# Altium project GZ7_1_x.PrjPcb
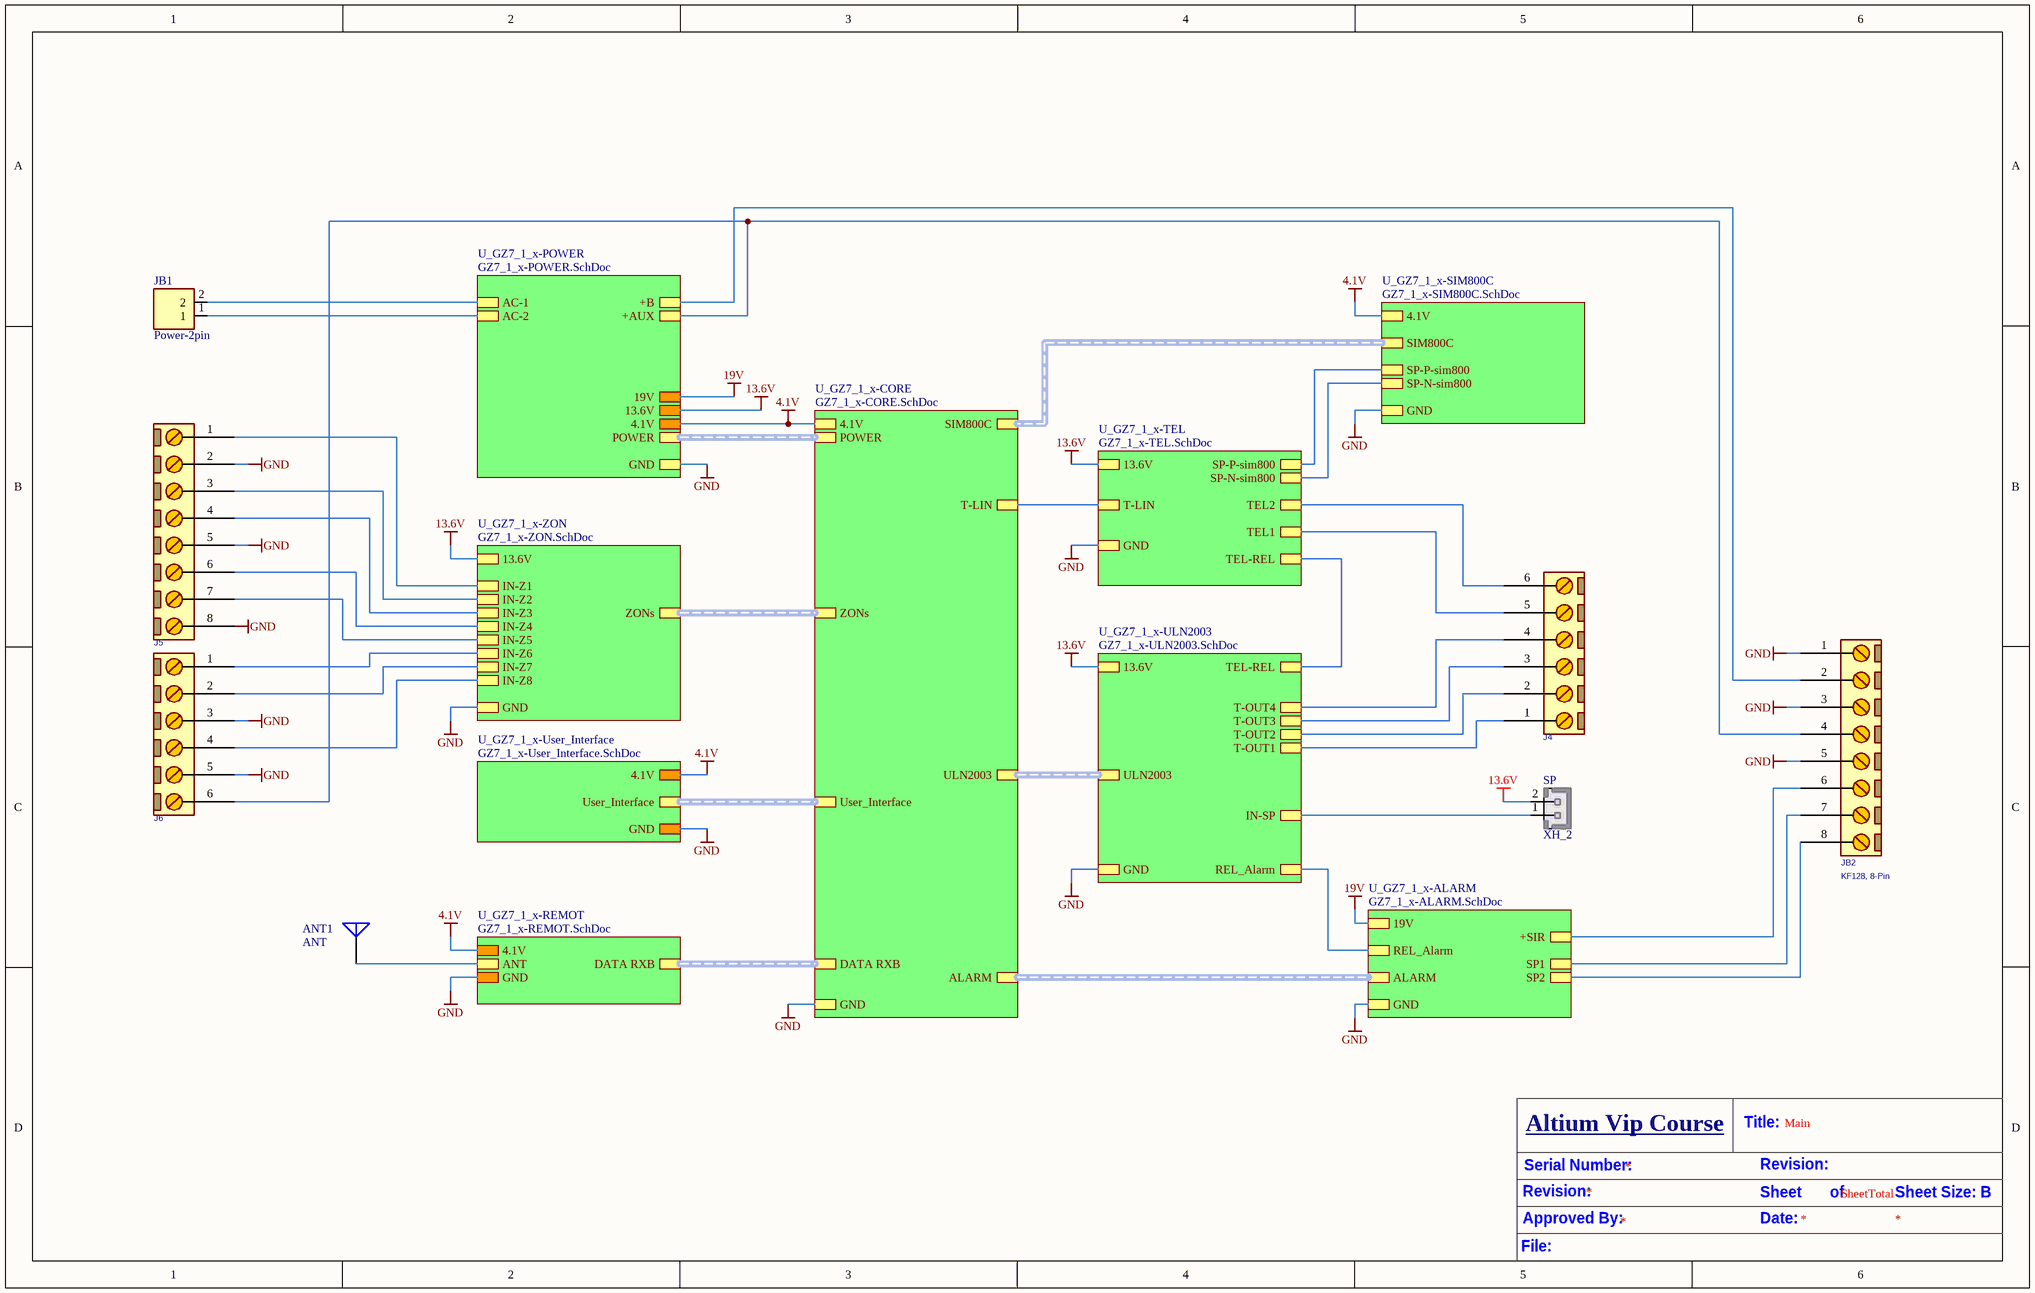
[diagram p0: Main.SchDoc]
10 sheets, 179 parts. Net scope: hierarchical (ports join the sheet entries above them; power ports are global).
Board file: GZ7_1_x.PcbDoc
Sheets:
  Main.SchDoc
    U_GZ7_1_x-POWER = GZ7_1_x-POWER.SchDoc
    U_GZ7_1_x-ZON = GZ7_1_x-ZON.SchDoc
    U_GZ7_1_x-User_Interface = GZ7_1_x-User_Interface.SchDoc
    U_GZ7_1_x-REMOT = GZ7_1_x-REMOT.SchDoc
    U_GZ7_1_x-CORE = GZ7_1_x-CORE.SchDoc
    U_GZ7_1_x-TEL = GZ7_1_x-TEL.SchDoc
    U_GZ7_1_x-ULN2003 = GZ7_1_x-ULN2003.SchDoc
    U_GZ7_1_x-SIM800C = GZ7_1_x-SIM800C.SchDoc
    U_GZ7_1_x-ALARM = GZ7_1_x-ALARM.SchDoc

## Sheet Main.SchDoc: Main
size B; SheetNumber: 1; SheetTotal: 10

### Parts
ANT1  ANT  [PAD-ANT]
J4  CONN_TB6  [T_4_OUT_TEL]  (value not drawn)
J5  CONN_TB8  [CON-Z_1_4]  (value not drawn)
J6  CONN_TB6  [CON-Z_5_8]  (value not drawn)
JB1  Power-2pin  [PWL_2]
JB2  KF128, 8-Pin  [CON8-AUX]
SP  XH_2  [XH_2]

### Sub-sheets
U_GZ7_1_x-ALARM = GZ7_1_x-ALARM.SchDoc: 19V, REL_Alarm, GND, +SIR, SP2, SP1, ALARM (harness a_ALARM)
U_GZ7_1_x-CORE = GZ7_1_x-CORE.SchDoc: 4.1V, GND, ZONs (harness ZON), SIM800C (harness SIM800C), ULN2003 (harness ULN2003), DATA RXB (harness RXB), POWER (harness a_POWER), User_Interface (harness User), ALARM (harness a_ALARM), T-LIN
U_GZ7_1_x-POWER = GZ7_1_x-POWER.SchDoc: 13.6V, 19V, 4.1V, GND, AC-2, AC-1, +B, +AUX, POWER (harness a_POWER)
U_GZ7_1_x-REMOT = GZ7_1_x-REMOT.SchDoc: 4.1V, GND, ANT, DATA RXB (harness RXB)
U_GZ7_1_x-SIM800C = GZ7_1_x-SIM800C.SchDoc: 4.1V, GND, SIM800C (harness SIM800C), SP-P-sim800, SP-N-sim800
U_GZ7_1_x-TEL = GZ7_1_x-TEL.SchDoc: GND, TEL-REL, TEL1, TEL2, 13.6V, T-LIN, SP-P-sim800, SP-N-sim800
U_GZ7_1_x-ULN2003 = GZ7_1_x-ULN2003.SchDoc: REL_Alarm, 13.6V, GND, T-OUT1, T-OUT2, T-OUT3, IN-SP, ULN2003 (harness ULN2003), T-OUT4, TEL-REL
U_GZ7_1_x-User_Interface = GZ7_1_x-User_Interface.SchDoc: User_Interface (harness User), 4.1V, GND
U_GZ7_1_x-ZON = GZ7_1_x-ZON.SchDoc: 13.6V, GND, IN-Z1, IN-Z2, IN-Z3, IN-Z4, ZONs (harness ZON), IN-Z5, IN-Z6, IN-Z7, IN-Z8

### Nets
4.1V: sheet U_GZ7_1_x-POWER/4.1V, sheet U_GZ7_1_x-User_Interface/4.1V, sheet U_GZ7_1_x-REMOT/4.1V, sheet U_GZ7_1_x-CORE/4.1V, sheet U_GZ7_1_x-SIM800C/4.1V
13.6V: SP.2 ; sheet U_GZ7_1_x-POWER/13.6V, sheet U_GZ7_1_x-ZON/13.6V, sheet U_GZ7_1_x-TEL/13.6V, sheet U_GZ7_1_x-ULN2003/13.6V
19V: sheet U_GZ7_1_x-POWER/19V, sheet U_GZ7_1_x-ALARM/19V  [project net +19V]
19V-AJIR: JB2.6 ; sheet U_GZ7_1_x-ALARM/+SIR
GND: J5.2 J5.5 J5.8 J6.3 J6.5 JB2.1 JB2.3 JB2.5 ; sheet U_GZ7_1_x-POWER/GND, sheet U_GZ7_1_x-ZON/GND, sheet U_GZ7_1_x-User_Interface/GND, sheet U_GZ7_1_x-REMOT/GND, sheet U_GZ7_1_x-CORE/GND, sheet U_GZ7_1_x-TEL/GND, sheet U_GZ7_1_x-ULN2003/GND, sheet U_GZ7_1_x-SIM800C/GND, sheet U_GZ7_1_x-ALARM/GND
+AUX: J6.6 JB2.4 ; sheet U_GZ7_1_x-POWER/+AUX
+BAT: JB2.2 ; sheet U_GZ7_1_x-POWER/+B
AC1: JB1.2 ; sheet U_GZ7_1_x-POWER/AC-1
AC2: JB1.1 ; sheet U_GZ7_1_x-POWER/AC-2
IN-Z1: J5.1 ; sheet U_GZ7_1_x-ZON/IN-Z1
IN-Z2: J5.3 ; sheet U_GZ7_1_x-ZON/IN-Z2
IN-Z3: J5.4 ; sheet U_GZ7_1_x-ZON/IN-Z3
IN-Z4: J5.6 ; sheet U_GZ7_1_x-ZON/IN-Z4
IN-Z5: J5.7 ; sheet U_GZ7_1_x-ZON/IN-Z5
IN-Z6: J6.1 ; sheet U_GZ7_1_x-ZON/IN-Z6
IN-Z7: J6.2 ; sheet U_GZ7_1_x-ZON/IN-Z7
IN-Z8: J6.4 ; sheet U_GZ7_1_x-ZON/IN-Z8
Rel Alarm: sheet U_GZ7_1_x-ULN2003/REL_Alarm, sheet U_GZ7_1_x-ALARM/REL_Alarm
SP1: JB2.7 ; sheet U_GZ7_1_x-ALARM/SP1
SP2: JB2.8 ; sheet U_GZ7_1_x-ALARM/SP2
SP-N-sim800: sheet U_GZ7_1_x-TEL/SP-N-sim800, sheet U_GZ7_1_x-SIM800C/SP-N-sim800
SP-P-sim800: sheet U_GZ7_1_x-TEL/SP-P-sim800, sheet U_GZ7_1_x-SIM800C/SP-P-sim800
T-LIN: sheet U_GZ7_1_x-CORE/T-LIN, sheet U_GZ7_1_x-TEL/T-LIN
TEL1: J4.5 ; sheet U_GZ7_1_x-TEL/TEL1
TEL2: J4.6 ; sheet U_GZ7_1_x-TEL/TEL2
TEL-REL: sheet U_GZ7_1_x-TEL/TEL-REL, sheet U_GZ7_1_x-ULN2003/TEL-REL
NetANT1_1: ANT1.1(A) ; sheet U_GZ7_1_x-REMOT/ANT
NetJ4_1: J4.1 ; sheet U_GZ7_1_x-ULN2003/T-OUT1
NetJ4_2: J4.2 ; sheet U_GZ7_1_x-ULN2003/T-OUT2
NetJ4_3: J4.3 ; sheet U_GZ7_1_x-ULN2003/T-OUT3
NetJ4_4: J4.4 ; sheet U_GZ7_1_x-ULN2003/T-OUT4
NetR52_2: SP.1 ; sheet U_GZ7_1_x-ULN2003/IN-SP

### Buses and harness runs
harness sheet U_GZ7_1_x-ALARM/ALARM = sheet U_GZ7_1_x-CORE/ALARM
harness sheet U_GZ7_1_x-CORE/DATA RXB = sheet U_GZ7_1_x-REMOT/DATA RXB
harness sheet U_GZ7_1_x-CORE/POWER = sheet U_GZ7_1_x-POWER/POWER
harness sheet U_GZ7_1_x-CORE/SIM800C = sheet U_GZ7_1_x-SIM800C/SIM800C
harness sheet U_GZ7_1_x-CORE/ULN2003 = sheet U_GZ7_1_x-ULN2003/ULN2003
harness sheet U_GZ7_1_x-CORE/User_Interface = sheet U_GZ7_1_x-User_Interface/User_Interface
harness sheet U_GZ7_1_x-CORE/ZONs = sheet U_GZ7_1_x-ZON/ZONs

### Notes on the sheet
- Serial Number:
- Altium Vip Course
- Title:
- Revision:
- Approved By:
- Date:
- Sheet       of
- SheetTotal
- Sheet Size: B
- File:

### Library data of the parts
ANT1 = Antenna: Multilayer Chip Antenna; Published: 24-Mar-1999; LatestRevisionDate: 17-Jul-2002; LatestRevisionNote: Re-released for DXP Platform.; PackageReference: PIN1; Publisher: Altium Limited
J4 J6 = CONN_TB6: CONN, TERMINAL BLOCK, 5.08mm pitch; VALUE: CONN_TB6
J5 JB2 = CONN_TB8: CONN, TERMINAL BLOCK, 5.08mm pitch; VALUE: CONN_TB8
JB1 = CONN_PWL_2: Power Terminal 2pin,Header, 2-Pin; VALUE: CONN_PWL_2
SP = XH_2: PW10-x-M, JST-BxB-XH-A pitch: 2.5mm, 3A/250v; MANF: JST; MANF_P#: B2B-XH-A; PARAM2: 250v; PARAM: 3.0A; VALUE: XH_2

## Sheet GZ7_1_x-POWER.SchDoc: GZ8-4-0
size B; SheetNumber: 5; SheetTotal: 9
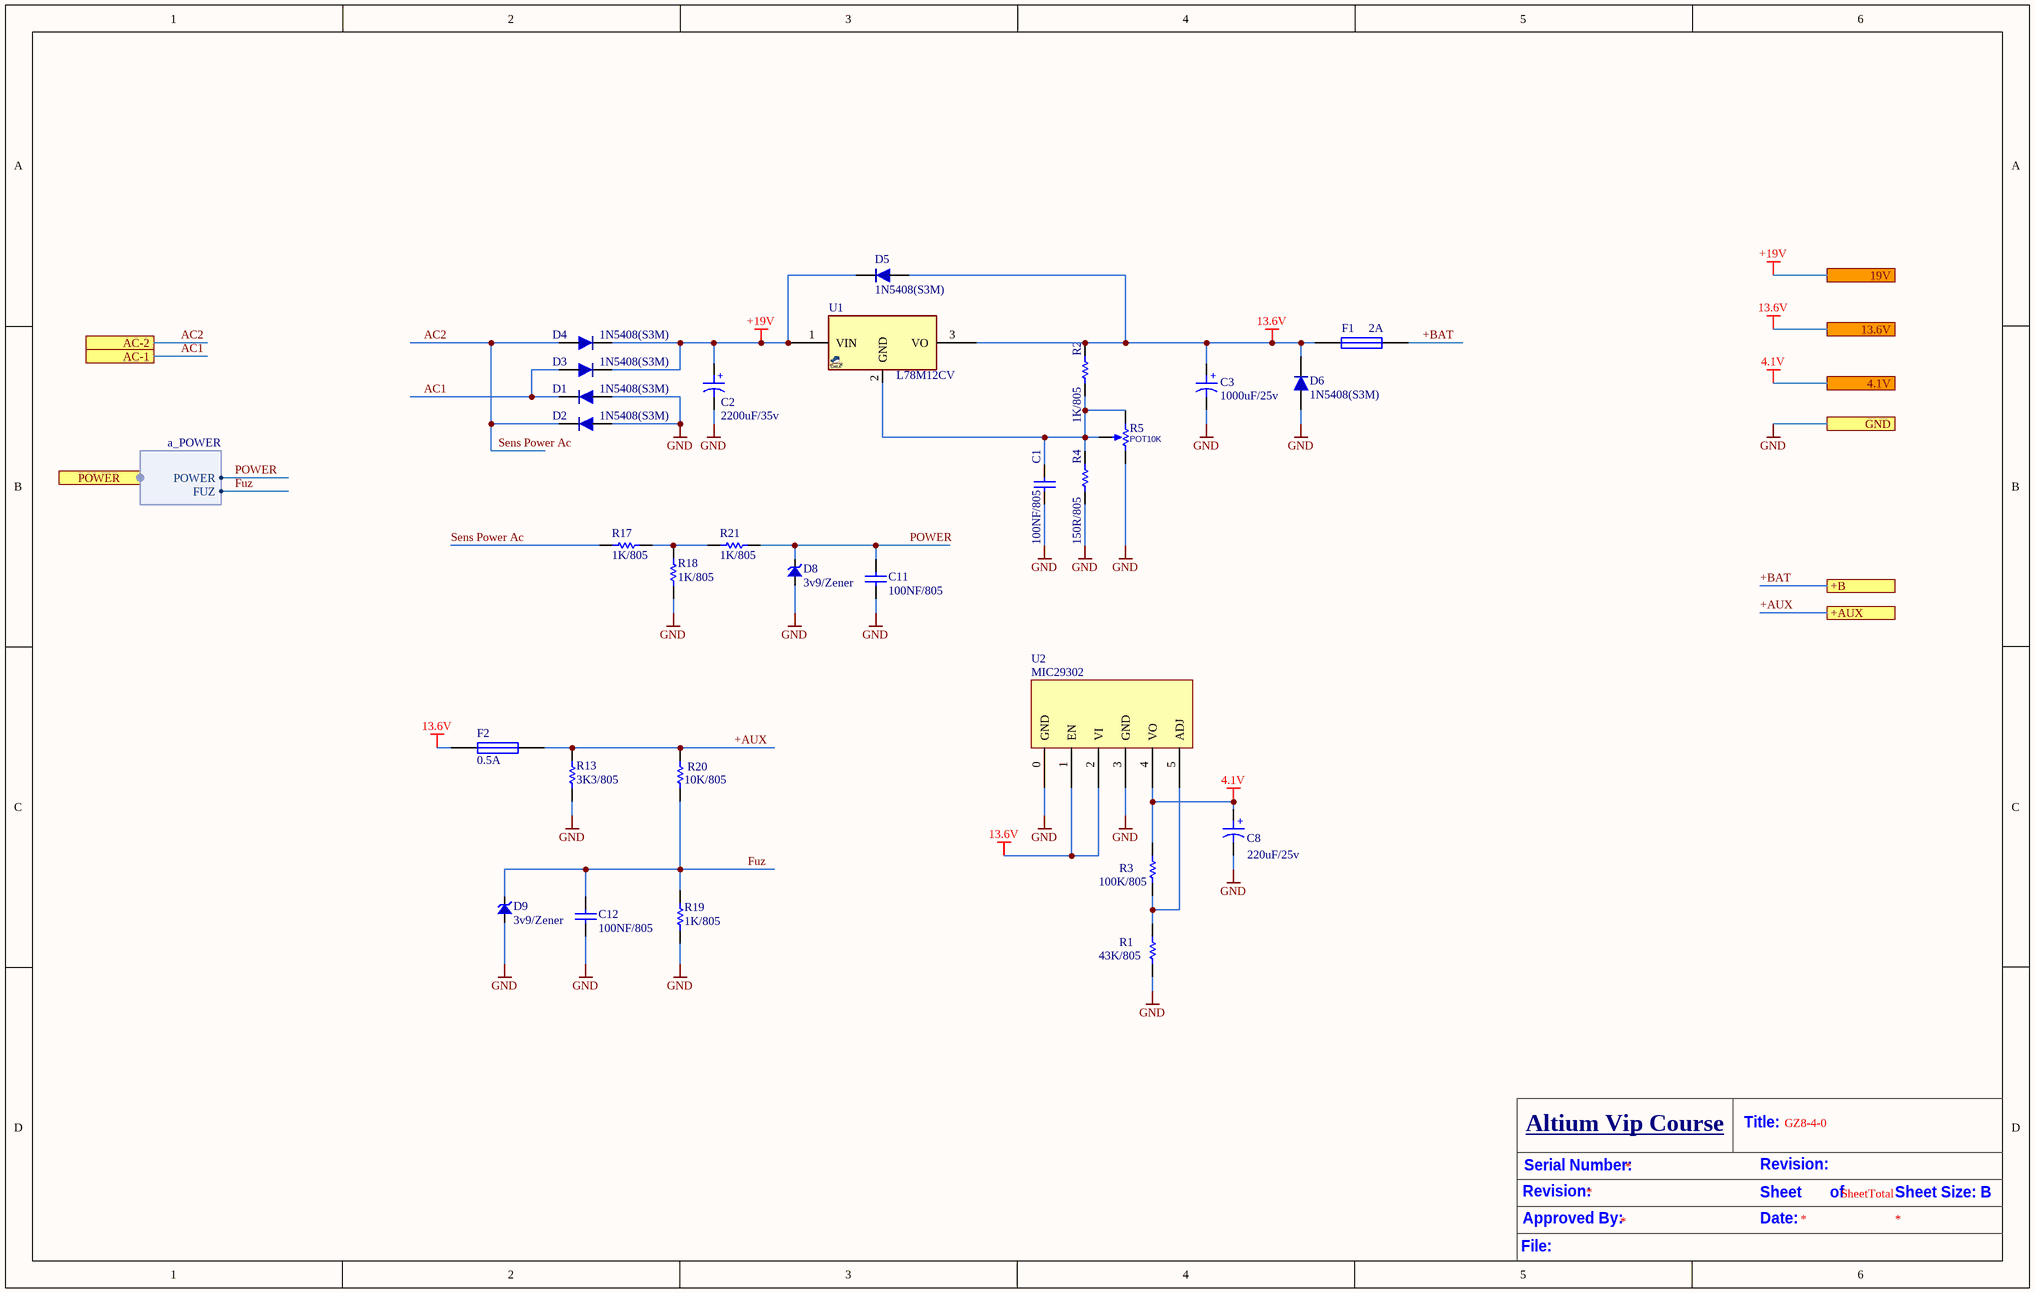
[diagram p1: GZ7_1_x-POWER.SchDoc]

### Parts
C1  100NF/805  [MY805 COP]
C2  2200uF/35v  [C_EL_10X16]
C3  1000uF/25v  [C_EL_10X16]
C8  220uF/25v  [C_EL_8X14]
C11  100NF/805  [MY805 COP]
C12  100NF/805  [MY805 COP]
D1  1N5408(S3M)  [DIOD_5408]
D2  1N5408(S3M)  [DIOD_5408]
D3  1N5408(S3M)  [DIOD_5408]
D4  1N5408(S3M)  [DIOD_5408]
D5  1N5408(S3M)  [DIOD_5408]
D6  1N5408(S3M)  [DIOD_5408]
D8  3v9/Zener  [my-DO5X.1.5]
D9  3v9/Zener  [my-DO5X.1.5]
F1  2A  [Fuse 5x20 With holder pin]
F2  0.5A  [Fuse 5x20 With holder pin]
R1  43K/805  [my805]
R2  1K/805  [my805]
R3  100K/805  [my805]
R4  150R/805  [my805]
R5  POT10K  [POT_7X5]
R13  3K3/805  [my805]
R17  1K/805  [my805]
R18  1K/805  [my805]
R19  1K/805  [my805]
R20  10K/805  [my805]
R21  1K/805  [my805]
U1  L78M12CV  [HSINK_TO220E]
U2  MIC29302  [my29302]

### Ports
4.1V, 13.6V, 19V, +AUX, +B, AC-1, AC-2, GND, POWER (harness a_POWER)

### Harnesses
a_POWER: POWER, FUZ

### Nets
4.1V: C8.1 R3.2 U2.4(VO) ; port 4.1V
13.6V: C3.1 D5.1 D6.2 F1.1 F2.1 R2.2 U1.3(VO) U2.1(EN) U2.2(VI) ; port 13.6V
+19V: C2.1 D3.2 D4.2 D5.2 U1.1(VIN) ; port 19V
GND: C1.1 C2.2 C3.2 C8.2 C11.1 C12.1 D1.1 D2.1 D6.1 D8.1 D9.1 R1.1 R4.1 R5.3(BOT) R13.1 R18.1 R19.1 U2.0(GND) U2.3(GND) ; port GND
+AUX: F2.2 R13.2 R20.2 ; port +AUX
+BAT: F1.2 ; port +B
AC1: D1.2 D3.1 ; port AC-1
AC2: D2.2 D4.1 R17.1 ; port AC-2  [also labelled Sens Power Ac]
Fuz: C12.2 D9.2 R19.2 R20.1 ; port POWER.FUZ
POWER: C11.2 D8.2 R21.2 ; port POWER.POWER
NetC1_2: C1.2 R2.1 R4.2 R5.1(TOP) R5.2(TAP) U1.2(GND)
NetR1_2: R1.2 R3.1 U2.5(ADJ)
NetR17_2: R17.2 R18.2 R21.1

### Notes on the sheet
- Serial Number:
- Altium Vip Course
- Title:
- Revision:
- Approved By:
- Date:
- Sheet       of
- SheetTotal
- Sheet Size: B
- File:
- (in symbol Cap electrolitic radial 10x21) +
- (in symbol Cap electrolitic radial 18x26) +

### Library data of the parts
C1 C11 C12 = CAP SMD 0805: CAP 0805; Designer: Abbas Basereh; Desc.: CAP SMD 0805; Data: 16-12-2016
C2 = Cap electrolitic radial 18x26: Cap electrolitic radial; Designer: Abbas Basereh; Value: 3300uF25V; Data: 16-12-2016
C3 = Cap electrolitic radial 18x26: Cap electrolitic radial; Designer: Abbas Basereh; Data: 16-12-2016
C8 = Cap electrolitic radial 10x21: Cap electrolitic radial
D1-D6 = 1N5819: Diode; Designer: Abbas Basereh; Data: 16-12-2016; Link: *; Part. No: *
D8 D9 = Zener
F1 F2 = FUSE1: Fuse
R1-R4 R13 R17-R21 = RES 1206 0.25W: RES 805; Designer: Abbas Basereh; Desc.: RES SMD 1206; Data: 16-12-2016
R5 = RES_THD_POT_7X5: RESISTOR, THD, Potentiometer; VALUE: POT10K
U1 = VREG_78M12_TO220: REG, Linear, Fixed, 12v, 1.5A, TO220; MANF_P#: L78M12CV, MC78M12CTG, UA78M12CKC; MANF: TI, ST, ON; PARAM: 12v, 1.5A; PARAM2: PARAM2; VALUE: L78M12CV
U2 = Component_1_1: PageSetup: 290302

## Sheet GZ7_1_x-ZON.SchDoc: GZ8-4-0
size B; SheetNumber: 10; SheetTotal: 10
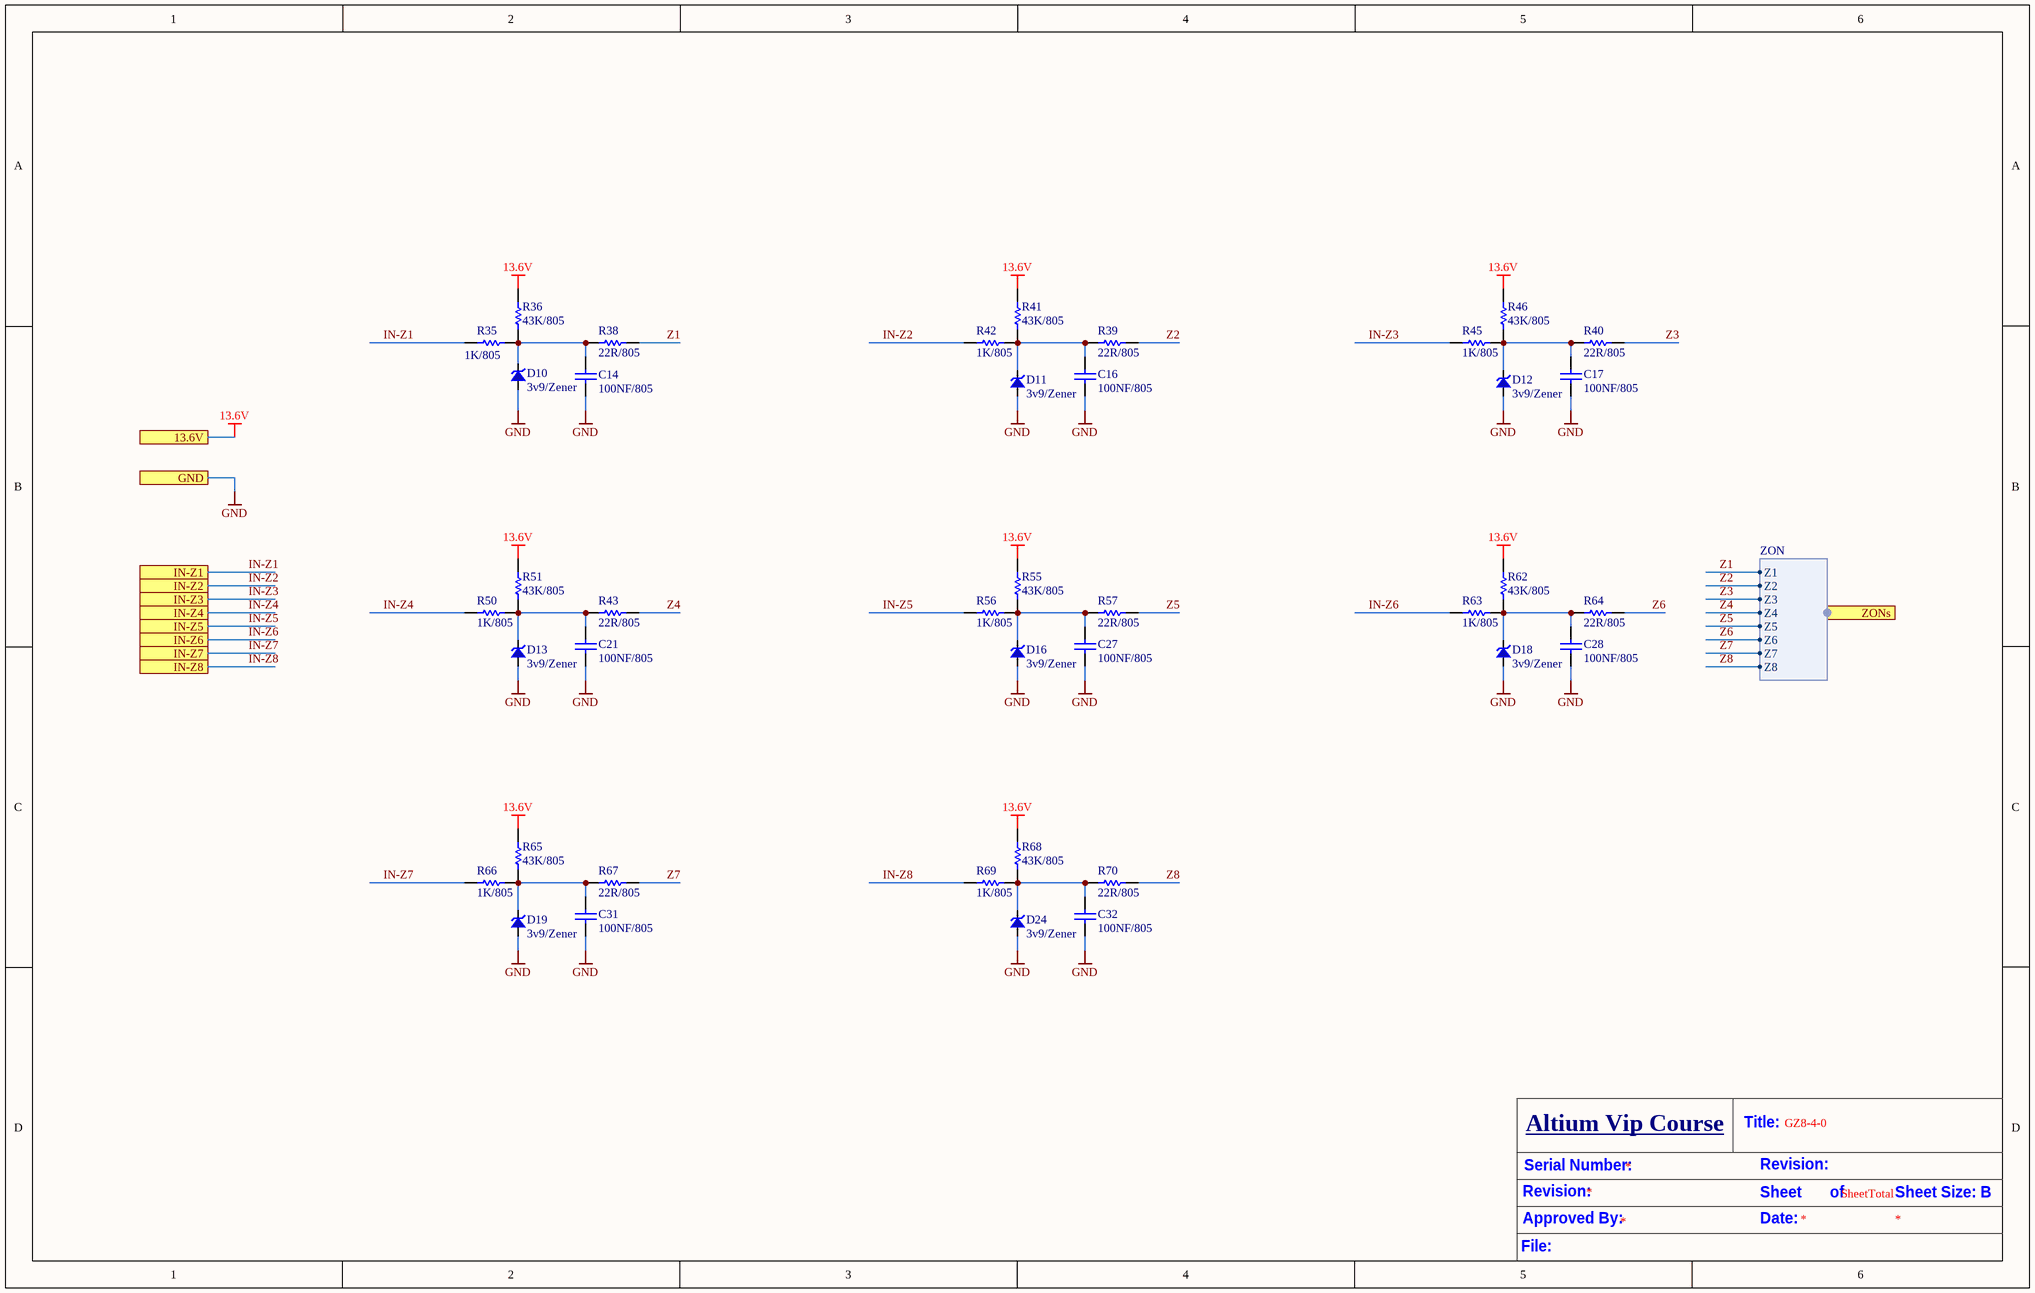
[diagram p2: GZ7_1_x-ZON.SchDoc]

### Parts
(Parts that share a designator on the sheet are numbered #1, #2 ... from top to bottom, then left to right.)
C14  100NF/805  [MY805 COP]
C16  100NF/805  [MY805 COP]
C17  100NF/805  [MY805 COP]
C21  100NF/805  [MY805 COP]
C27  100NF/805  [MY805 COP]
C28  100NF/805  [MY805 COP]
C31  100NF/805  [MY805 COP]
C32  100NF/805  [MY805 COP]
D10  3v9/Zener  [my-DO5X.1.5]
D11  3v9/Zener  [my-DO5X.1.5]
D12  3v9/Zener  [my-DO5X.1.5]
D13  3v9/Zener  [my-DO5X.1.5]
D16  3v9/Zener  [my-DO5X.1.5]
D18  3v9/Zener  [my-DO5X.1.5]
D19  3v9/Zener  [my-DO5X.1.5]
D24  3v9/Zener  [my-DO5X.1.5]
R35  1K/805  [my805]
R36  43K/805  [my805]
R38  22R/805  [my805]
R39  22R/805  [my805]
R40  22R/805  [my805]
R41  43K/805  [my805]
R42  1K/805  [my805]
R43  22R/805  [my805]
R45#1  1K/805  [my805]
R46  43K/805  [my805]
R50  1K/805  [my805]
R51  43K/805  [my805]
R55  43K/805  [my805]
R56  1K/805  [my805]
R57  22R/805  [my805]
R62  43K/805  [my805]
R63  1K/805  [my805]
R64  22R/805  [my805]
R65  43K/805  [my805]
R66  1K/805  [my805]
R67  22R/805  [my805]
R68  43K/805  [my805]
R69  1K/805  [my805]
R70  22R/805  [my805]

### Ports
13.6V, GND, IN-Z1, IN-Z2, IN-Z3, IN-Z4, IN-Z5, IN-Z6, IN-Z7, IN-Z8, ZONs (harness ZON)

### Harnesses
ZON: Z1, Z2, Z3, Z4, Z5, Z6, Z7, Z8

### Nets
13.6V: R36.1 R41.1 R46.1 R51.1 R55.1 R62.1 R65.1 R68.1 ; port 13.6V
GND: C14.1 C16.1 C17.1 C21.1 C27.1 C28.1 C31.1 C32.1 D10.1 D11.1 D12.1 D13.1 D16.1 D18.1 D19.1 D24.1 ; port GND
IN-Z1: R35.1 ; port IN-Z1
IN-Z2: R42.1 ; port IN-Z2
IN-Z3: R45#1.1 ; port IN-Z3
IN-Z4: R50.1 ; port IN-Z4
IN-Z5: R56.1 ; port IN-Z5
IN-Z6: R63.1 ; port IN-Z6
IN-Z7: R66.1 ; port IN-Z7
IN-Z8: R69.1 ; port IN-Z8
Z1: R38.1 ; port ZONs.Z1
Z2: R39.1 ; port ZONs.Z2
Z3: R40.1 ; port ZONs.Z3
Z4: R43.1 ; port ZONs.Z4
Z5: R57.1 ; port ZONs.Z5
Z6: R64.1 ; port ZONs.Z6
Z7: R67.1 ; port ZONs.Z7
Z8: R70.1 ; port ZONs.Z8
NetC14_2: C14.2 D10.2 R35.2 R36.2 R38.2
NetC16_2: C16.2 D11.2 R39.2 R41.2 R42.2
NetC17_2: C17.2 D12.2 R40.2 R45#1.2 R46.2
NetC21_2: C21.2 D13.2 R43.2 R50.2 R51.2
NetC27_2: C27.2 D16.2 R55.2 R56.2 R57.2
NetC28_2: C28.2 D18.2 R62.2 R63.2 R64.2
NetC31_2: C31.2 D19.2 R65.2 R66.2 R67.2
NetC32_2: C32.2 D24.2 R68.2 R69.2 R70.2

### Notes on the sheet
- Serial Number:
- Altium Vip Course
- Title:
- Revision:
- Approved By:
- Date:
- Sheet       of
- SheetTotal
- Sheet Size: B
- File:

### Library data of the parts
C14 C16 C17 C21 C27 C28 C31 C32 = CAP SMD 0805: CAP 0805; Designer: Abbas Basereh; Desc.: CAP SMD 0805; Data: 16-12-2016
D10-D13 D16 D18 D19 D24 = Zener
R35 R36 R38-R43 R45#1 R50 R51 R55-R57 R62-R70 = RES 1206 0.25W: as R1 on sheet GZ7_1_x-POWER; Data: 16-12-2016
R46 = RES 1206 0.25W: RES 805

## Sheet GZ7_1_x-User_Interface.SchDoc
size B; SheetNumber: 9; SheetTotal: 10
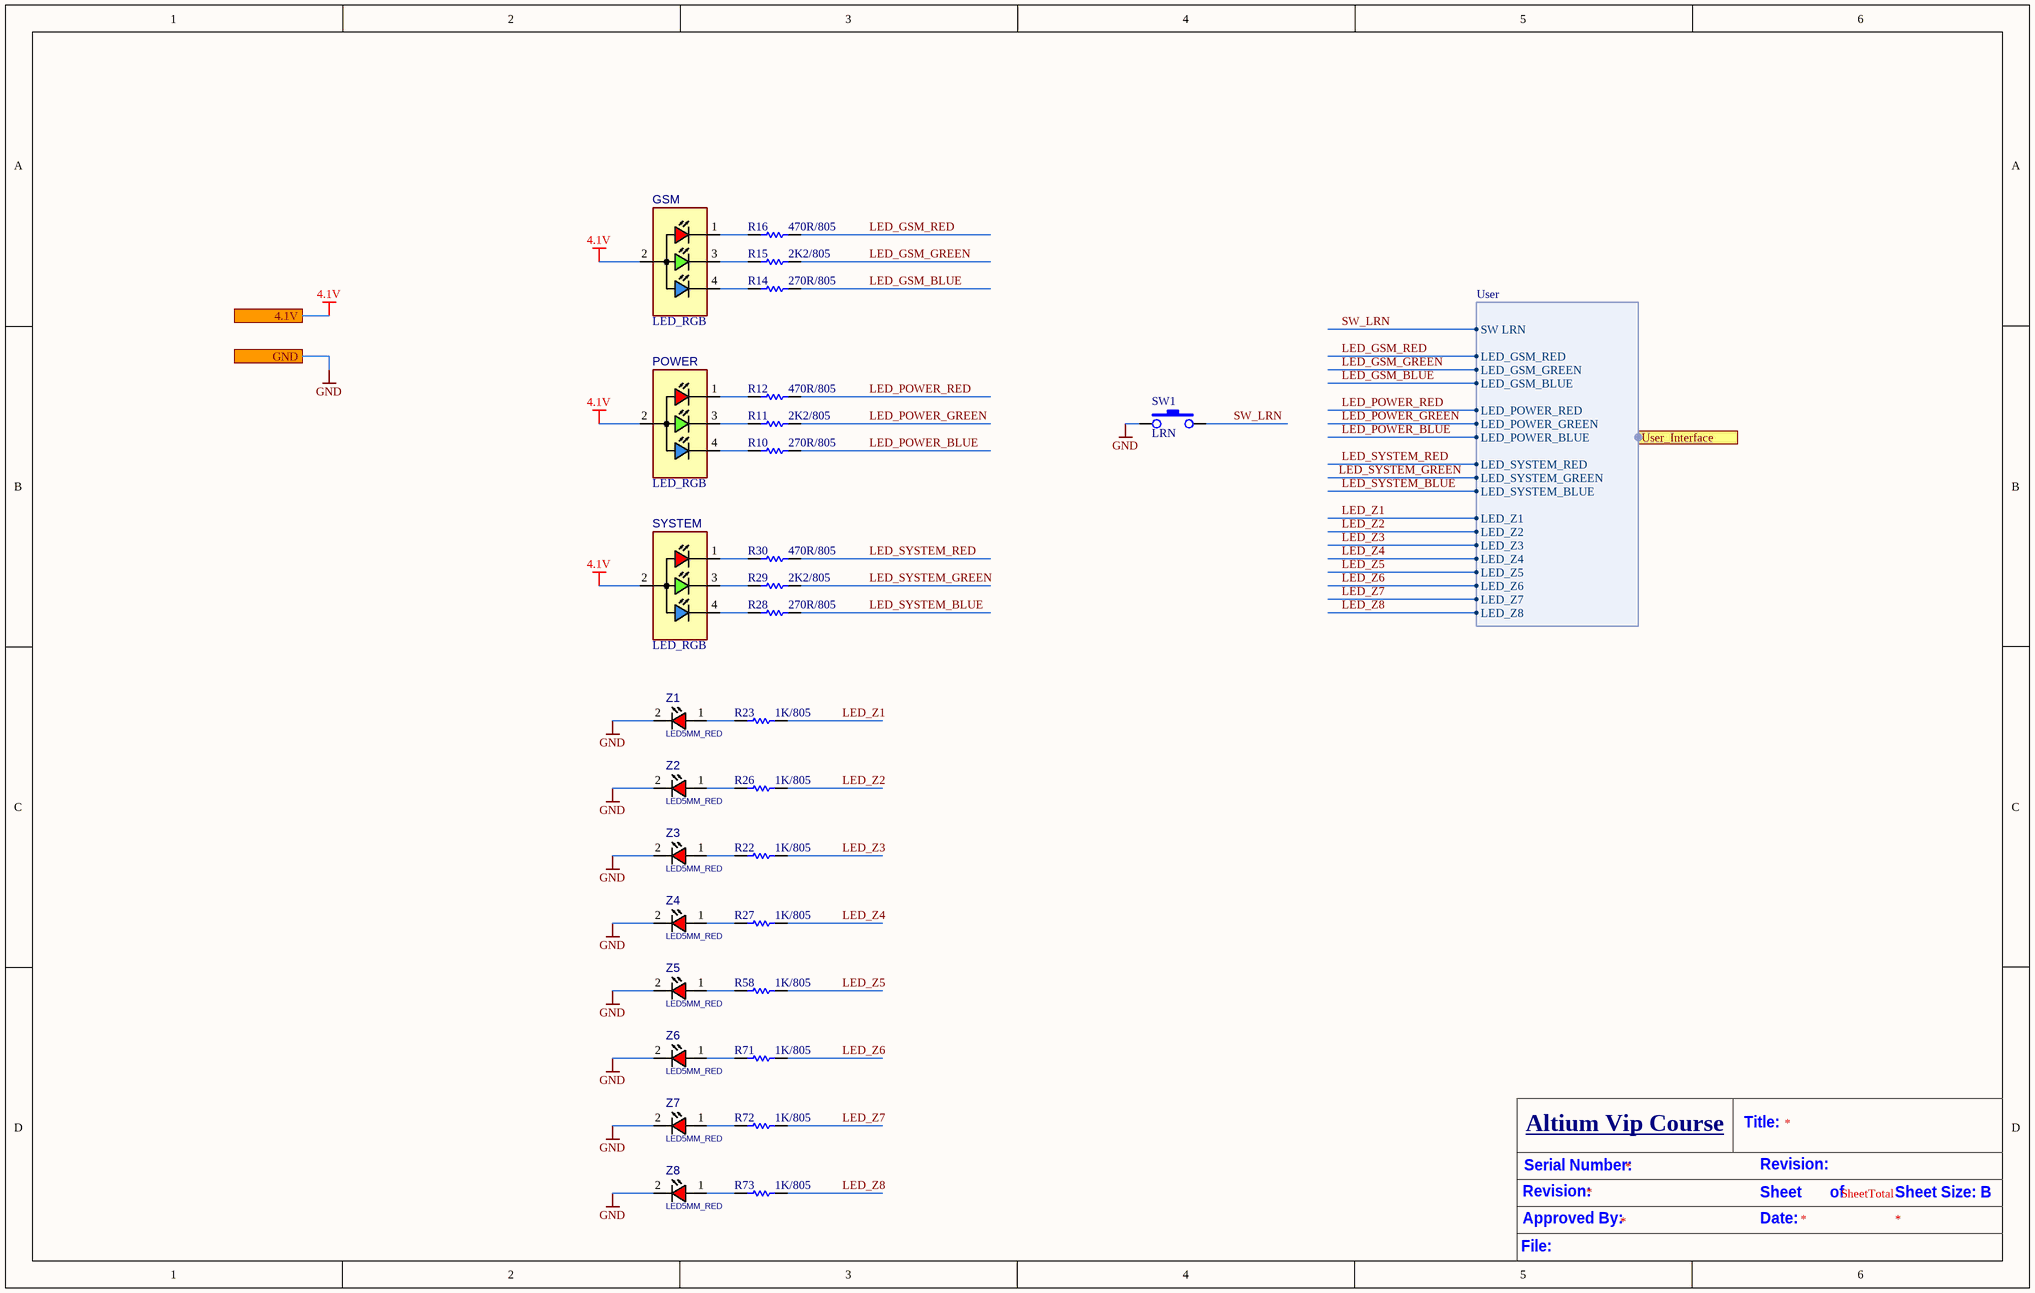
[diagram p3: GZ7_1_x-User_Interface.SchDoc]

### Parts
GSM  LED_RGB  [LED5RGB]
POWER  LED_RGB  [LED5RGB]
R10  270R/805  [my805]
R11  2K2/805  [my805]
R12  470R/805  [my805]
R14  270R/805  [my805]
R15  2K2/805  [my805]
R16  470R/805  [my805]
R22  1K/805  [my805]
R23  1K/805  [my805]
R26  1K/805  [my805]
R27  1K/805  [my805]
R28  270R/805  [my805]
R29  2K2/805  [my805]
R30  470R/805  [my805]
R58  1K/805  [my805]
R71  1K/805  [my805]
R72  1K/805  [my805]
R73  1K/805  [my805]
SW1  LRN  [SWPBS_SPST_6X3X5]
SYSTEM  LED_RGB  [LED5RGB]
Z1  LED5MM_RED  [LED_SMD_0805]
Z2  LED5MM_RED  [LED_SMD_0805]
Z3  LED5MM_RED  [LED_SMD_0805]
Z4  LED5MM_RED  [LED_SMD_0805]
Z5  LED5MM_RED  [LED_SMD_0805]
Z6  LED5MM_RED  [LED_SMD_0805]
Z7  LED5MM_RED  [LED_SMD_0805]
Z8  LED5MM_RED  [LED_SMD_0805]

### Ports
4.1V, GND, User_Interface (harness User)

### Harnesses
User: SW LRN, LED_GSM_GREEN, LED_GSM_BLUE, LED_POWER_RED, LED_POWER_GREEN, LED_POWER_BLUE, LED_SYSTEM_RED, LED_SYSTEM_GREEN, LED_SYSTEM_BLUE, LED_GSM_RED, LED_Z1, LED_Z2, LED_Z3, LED_Z4, LED_Z5, LED_Z6, LED_Z7, LED_Z8

### Nets
4.1V: GSM.2(C) POWER.2(C) SYSTEM.2(C) ; port 4.1V
GND: SW1.1 Z1.2(CATHODE) Z2.2(CATHODE) Z3.2(CATHODE) Z4.2(CATHODE) Z5.2(CATHODE) Z6.2(CATHODE) Z7.2(CATHODE) Z8.2(CATHODE) ; port GND
LED_GSM_BLUE: R14.2 ; port User_Interface.LED_GSM_BLUE
LED_GSM_GREEN: R15.2 ; port User_Interface.LED_GSM_GREEN
LED_GSM_RED: R16.2 ; port User_Interface.LED_GSM_RED
LED_POWER_BLUE: R10.2 ; port User_Interface.LED_POWER_BLUE
LED_POWER_GREEN: R11.2 ; port User_Interface.LED_POWER_GREEN
LED_POWER_RED: R12.2 ; port User_Interface.LED_POWER_RED
LED_SYSTEM_BLUE: R28.2 ; port User_Interface.LED_SYSTEM_BLUE
LED_SYSTEM_GREEN: R29.2 ; port User_Interface.LED_SYSTEM_GREEN
LED_SYSTEM_RED: R30.2 ; port User_Interface.LED_SYSTEM_RED
LED_Z1: R23.2 ; port User_Interface.LED_Z1
LED_Z2: R26.2 ; port User_Interface.LED_Z2
LED_Z3: R22.2 ; port User_Interface.LED_Z3
LED_Z4: R27.2 ; port User_Interface.LED_Z4
LED_Z5: R58.2 ; port User_Interface.LED_Z5
LED_Z6: R71.2 ; port User_Interface.LED_Z6
LED_Z7: R72.2 ; port User_Interface.LED_Z7
LED_Z8: R73.2 ; port User_Interface.LED_Z8
SW_LRN: SW1.2 ; port User_Interface.SW LRN
NetGSM_1: GSM.1(RED) R16.1
NetGSM_3: GSM.3(GRN) R15.1
NetGSM_4: GSM.4(BLU) R14.1
NetPOWER_1: POWER.1(RED) R12.1
NetPOWER_3: POWER.3(GRN) R11.1
NetPOWER_4: POWER.4(BLU) R10.1
NetR22_1: R22.1 Z3.1(ANODE)
NetR23_1: R23.1 Z1.1(ANODE)
NetR26_1: R26.1 Z2.1(ANODE)
NetR27_1: R27.1 Z4.1(ANODE)
NetR28_1: R28.1 SYSTEM.4(BLU)
NetR29_1: R29.1 SYSTEM.3(GRN)
NetR30_1: R30.1 SYSTEM.1(RED)
NetR58_1: R58.1 Z5.1(ANODE)
NetR71_1: R71.1 Z6.1(ANODE)
NetR72_1: R72.1 Z7.1(ANODE)
NetR73_1: R73.1 Z8.1(ANODE)

### Notes on the sheet
- Serial Number:
- Altium Vip Course
- Title:
- Revision:
- Approved By:
- Date:
- Sheet       of
- SheetTotal
- Sheet Size: B
- File:

### Library data of the parts
GSM POWER SYSTEM = LED_THD_5MM_RGB_CA: LED, THD, 5MM, RGB COMMON CATHODE; MANF_P#: YSL-R596CR3G4B5C-C10; MANF: CHINA YOUNG; DESC: DESCRIPTION; ASSEMBLY: ASSEMBLY; PRICE: PRICE; VALUE: LED_RGB
R10-R12 R14-R16 R22 R23 R26-R30 R58 R71-R73 = RES 1206 0.25W: as R1 on sheet GZ7_1_x-POWER; Data: 16-12-2016
SW1 = SW-PB
Z1-Z8 = LED_THD_5MM_RED: LED, THD, 5MM, RED; DESC: DESCRIPTION; MANF_P#: MANF_PART#; PARAM2: 2.2V; MANF: MANF; ASSEMBLY: ASSEMBLY; PRICE: PRICE; VALUE: LED5MM_RED

## Sheet GZ7_1_x-REMOT.SchDoc: GZ8-4-0
size B; SheetNumber: 6; SheetTotal: 9
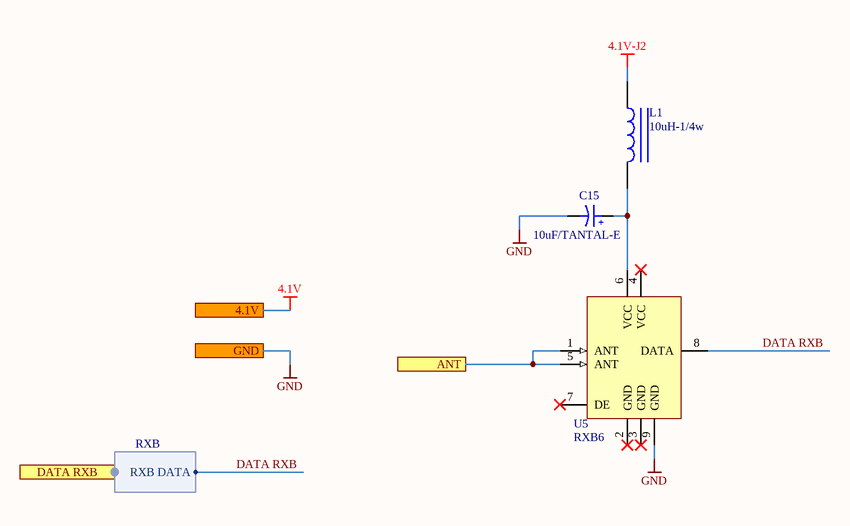
[diagram p4: GZ7_1_x-REMOT.SchDoc]

### Parts
C15  10uF/TANTAL-E  [C_TN_3528]
L1  10uH-1/4w  [Resistor_0.25w-0.4]
U5  RXB6  [RXB_6]

### Ports
4.1V, ANT, DATA RXB (harness RXB), GND

### Harnesses
RXB: RXB DATA

### Nets
4.1V-J2: L1.1
GND: C15.2 U5.9(GND) ; port GND
DATA RXB: U5.8(DATA) ; port DATA RXB.RXB DATA
NetANT1_1: U5.1(ANT) U5.5(ANT) ; port ANT
NetC15_1: C15.1 L1.2 U5.6(VCC)

Not connected (* = marked no-connect by the designer): U5 2(GND)* 3(GND)* 4(VCC)* 7(DE)*

### Notes on the sheet
- Serial Number:
- Altium Vip Course
- Title:
- Revision:
- Approved By:
- Date:
- Sheet       of
- SheetTotal
- Sheet Size: B
- File:
- (in symbol Cap electrolitic radial 10x21) +

### Library data of the parts
C15 = Cap electrolitic radial 10x21: Cap electrolitic radial; Part. No: 100U/50V; Designer: Abbas Basereh; Data: 16-12-2016
L1 = INDUCTOR IRON: INDUCTOR 1/4w

## Sheet GZ7_1_x-CORE.SchDoc: GZ8-4-0
size B; SheetNumber: 3; SheetTotal: 10
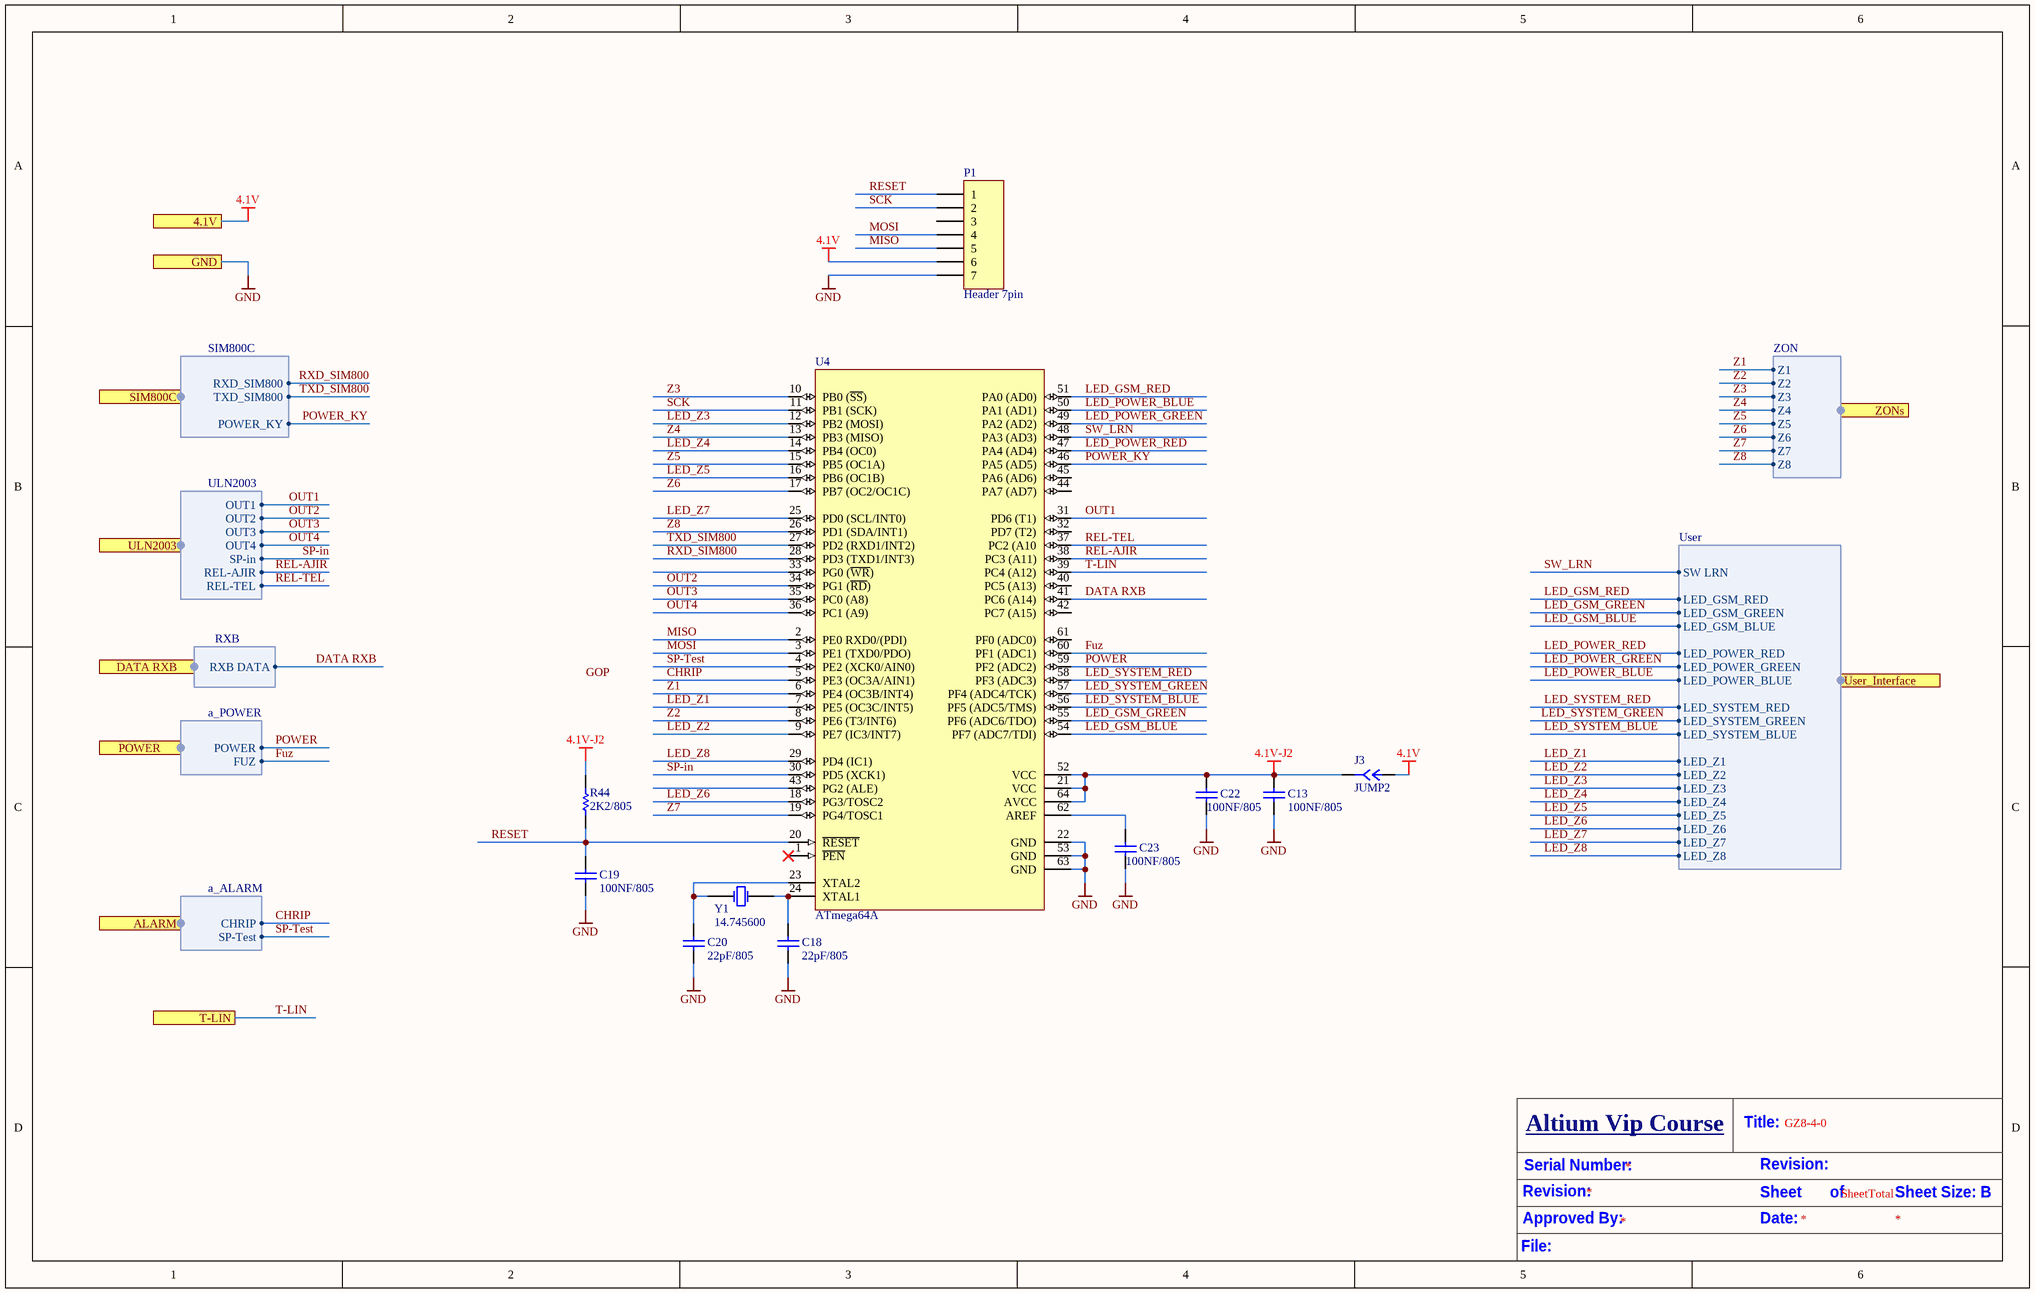
[diagram p5: GZ7_1_x-CORE.SchDoc]

### Parts
C13  100NF/805  [MY805 COP]
C18  22pF/805  [MY805 COP]
C19  100NF/805  [MY805 COP]
C20  22pF/805  [MY805 COP]
C22  100NF/805  [MY805 COP]
C23  100NF/805  [MY805 COP]
J3  JUMP2  [JUMP3]
P1  Header 7pin  [HDR_P_GZ4]
R44  2K2/805  [my805]
U4  ATmega64A  [TQFP64_GZ4E_1]
Y1  14.745600  [Crystal SMD]

### Ports
4.1V, ALARM (harness a_ALARM), DATA RXB (harness RXB), GND, POWER (harness a_POWER), SIM800C (harness SIM800C), T-LIN, ULN2003 (harness ULN2003), User_Interface (harness User), ZONs (harness ZON)

### Harnesses
SIM800C: TXD_SIM800, RXD_SIM800, POWER_KY
ULN2003: OUT1, OUT2, OUT3, SP-in, REL-AJIR, OUT4, REL-TEL
RXB: RXB DATA
a_POWER: POWER, FUZ
a_ALARM: SP-Test, CHRIP
ZON: Z1, Z2, Z3, Z4, Z5, Z6, Z7, Z8
User: SW LRN, LED_GSM_GREEN, LED_GSM_BLUE, LED_POWER_RED, LED_POWER_GREEN, LED_POWER_BLUE, LED_SYSTEM_RED, LED_SYSTEM_GREEN, LED_SYSTEM_BLUE, LED_GSM_RED, LED_Z1, LED_Z2, LED_Z3, LED_Z4, LED_Z5, LED_Z6, LED_Z7, LED_Z8

### Nets
4.1V: J3.2 P1.6 ; port 4.1V
4.1V-J2: C13.1 C22.1 J3.1 R44.1 U4.21(VCC) U4.52(VCC) U4.64(AVCC)
GND: C13.2 C18.2 C19.2 C20.2 C22.2 C23.2 P1.7 U4.22(GND) U4.53(GND) U4.63(GND) ; port GND
CHRIP: U4.5(PE3_(OC3A/AIN1)) ; port ALARM.CHRIP
DATA RXB: U4.41(PC6_(A14)) ; port DATA RXB.RXB DATA
Fuz: U4.60(PF1_(ADC1)) ; port POWER.FUZ
LED_GSM_BLUE: U4.54(PF7_(ADC7/TDI)) ; port User_Interface.LED_GSM_BLUE
LED_GSM_GREEN: U4.55(PF6_(ADC6/TDO)) ; port User_Interface.LED_GSM_GREEN
LED_GSM_RED: U4.51(PA0_(AD0)) ; port User_Interface.LED_GSM_RED
LED_POWER_BLUE: U4.50(PA1_(AD1)) ; port User_Interface.LED_POWER_BLUE
LED_POWER_GREEN: U4.49(PA2_(AD2)) ; port User_Interface.LED_POWER_GREEN
LED_POWER_RED: U4.47(PA4_(AD4)) ; port User_Interface.LED_POWER_RED
LED_SYSTEM_BLUE: U4.56(PF5_(ADC5/TMS)) ; port User_Interface.LED_SYSTEM_BLUE
LED_SYSTEM_GREEN: U4.57(PF4_(ADC4/TCK)) ; port User_Interface.LED_SYSTEM_GREEN
LED_SYSTEM_RED: U4.58(PF3_(ADC3)) ; port User_Interface.LED_SYSTEM_RED
LED_Z1: U4.7(PE5_(OC3C/INT5)) ; port User_Interface.LED_Z1
LED_Z2: U4.9(PE7_(IC3/INT7)) ; port User_Interface.LED_Z2
LED_Z3: U4.12(PB2_(MOSI)) ; port User_Interface.LED_Z3
LED_Z4: U4.14(PB4_(OC0)) ; port User_Interface.LED_Z4
LED_Z5: U4.16(PB6_(OC1B)) ; port User_Interface.LED_Z5
LED_Z6: U4.18(PG3/TOSC2) ; port User_Interface.LED_Z6
LED_Z7: U4.25(PD0_(SCL/INT0)) ; port User_Interface.LED_Z7
LED_Z8: U4.29(PD4_(IC1)) ; port User_Interface.LED_Z8
MISO: P1.5 U4.2(PE0_RXD0/(PDI))
MOSI: P1.4 U4.3(PE1_(TXD0/PDO))
OUT1: U4.31(PD6_(T1)) ; port ULN2003.OUT1
OUT2: U4.34(PG1_(~{RD})) ; port ULN2003.OUT2
OUT3: U4.35(PC0_(A8)) ; port ULN2003.OUT3
OUT4: U4.36(PC1_(A9)) ; port ULN2003.OUT4
POWER: U4.59(PF2_(ADC2)) ; port POWER.POWER
POWER_KY: U4.46(PA5_(AD5)) ; port SIM800C.POWER_KY
REL-AJIR: U4.38(PC3_(A11)) ; port ULN2003.REL-AJIR
REL-TEL: U4.37(PC2_(A10) ; port ULN2003.REL-TEL
RESET: C19.1 P1.1 R44.2 U4.20(~{RESET})
RXD_SIM800: U4.28(PD3_(TXD1/INT3)) ; port SIM800C.RXD_SIM800
SCK: P1.2 U4.11(PB1_(SCK))
SP-in: U4.30(PD5_(XCK1)) ; port ULN2003.SP-in
SP-Test: U4.4(PE2_(XCK0/AIN0)) ; port ALARM.SP-Test
SW_LRN: U4.48(PA3_(AD3)) ; port User_Interface.SW LRN
T-LIN: U4.39(PC4_(A12)) ; port T-LIN
TXD_SIM800: U4.27(PD2_(RXD1/INT2)) ; port SIM800C.TXD_SIM800
Z1: U4.6(PE4_(OC3B/INT4)) ; port ZONs.Z1
Z2: U4.8(PE6_(T3/INT6)) ; port ZONs.Z2
Z3: U4.10(PB0_(~{SS})) ; port ZONs.Z3
Z4: U4.13(PB3_(MISO)) ; port ZONs.Z4
Z5: U4.15(PB5_(OC1A)) ; port ZONs.Z5
Z6: U4.17(PB7_(OC2/OC1C)) ; port ZONs.Z6
Z7: U4.19(PG4/TOSC1) ; port ZONs.Z7
Z8: U4.26(PD1_(SDA/INT1)) ; port ZONs.Z8
NetC18_1: C18.1 U4.24(XTAL1) Y1.2(OSC2)
NetC20_1: C20.1 U4.23(XTAL2) Y1.1(OSC1)
NetC23_1: C23.1 U4.62(AREF)

Not connected (* = marked no-connect by the designer): P1 3; U4 1(~{PEN})* 32(PD7_(T2)) 33(PG0_(~{WR})) 40(PC5_(A13)) 42(PC7_(A15)) 43(PG2_(ALE)) 44(PA7_(AD7)) 45(PA6_(AD6)) 61(PF0_(ADC0))

### Notes on the sheet
- Labels drawn without touching a wire or pin: GOP
- Serial Number:
- Altium Vip Course
- Title:
- Revision:
- Approved By:
- Date:
- Sheet       of
- SheetTotal
- Sheet Size: B
- File:

### Library data of the parts
C13 C19 C22 C23 = Cap Semi: CAP 0805; Value: 100pF; Published: 8-Jun-2000; LatestRevisionDate: 29-May-2009; LatestRevisionNote: IPC-7351 Footprint Added.; PackageReference: C1206; Publisher: Altium Limited; PackageDescription: Chip Capacitor
C18 C20 = Cap Semi: CAP 0805; Value: 22pF; Published: 8-Jun-2000; LatestRevisionDate: 29-May-2009; LatestRevisionNote: IPC-7351 Footprint Added.; PackageReference: C1206; Publisher: Altium Limited; PackageDescription: Chip Capacitor
P1 = Header 7: Header, 7-Pin; LatestRevisionDate: 17-Jul-2002; LatestRevisionNote: Re-released for DXP Platform.; Publisher: Altium Limited
R44 = Res1: RES 805; Value: 10K; Published: 8-Jun-2000; LatestRevisionDate: 17-Jul-2002; LatestRevisionNote: Re-released for DXP Platform.; PackageReference: AXIAL-0.3; Publisher: Altium Limited
U4 = ATmega64-16AC: 8-Bit AVR Microcontroller; Published: 17-Sep-2003; LatestRevisionDate: 13-Apr-2006; LatestRevisionNote: IPC-7351 Footprint Added.; DatasheetVersion: 2490C-AVR-009/02; PackageVersion: revB, Oct-2001; PackageReference: 64A; Publisher: Altium Limited; PackageDescription: 64-Pin Thin Quad Flat Pack 0.8 mm Pitch; Code_JEDEC: MS-026-AEB; ComponentLink1Description: Manufacturer Link; ComponentLink1URL: http://www.atmel.com; ComponentLink2Description: Datasheet; ComponentLink2URL: http://www.atmel.com/dyn/resources/prod_documents/doc2490.pdf
Y1 = XTAL: Crystal Oscillator; Published: 8-Jun-2000; LatestRevisionDate: 17-Jul-2002; LatestRevisionNote: Re-released for DXP Platform.; PackageReference: R38; Publisher: Altium Limited

## Sheet GZ7_1_x-TEL.SchDoc: GZ8-4-0
size B; SheetNumber: 10; SheetTotal: 10
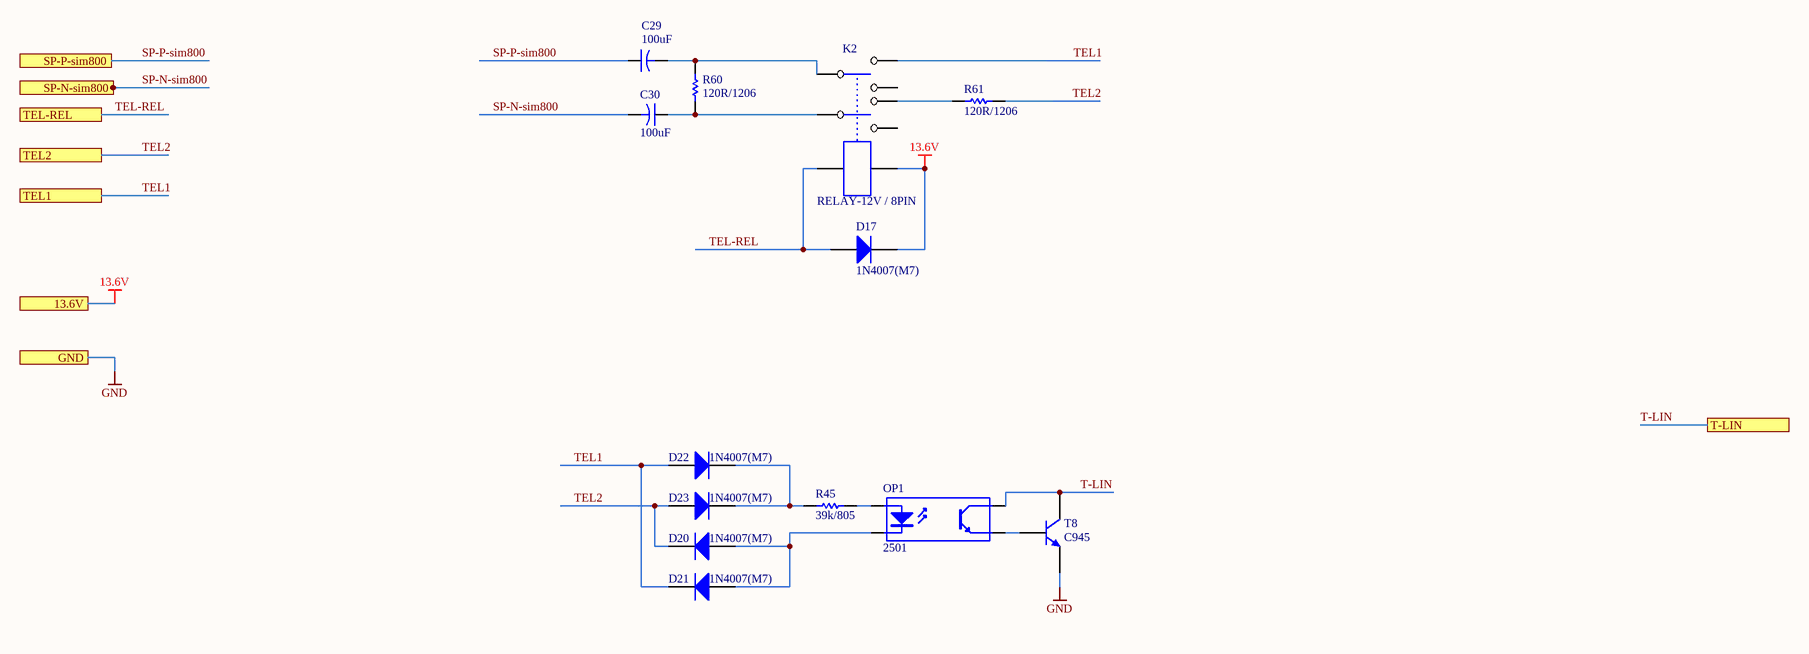
[diagram p6: GZ7_1_x-TEL.SchDoc]

### Parts
(Parts that share a designator on the sheet are numbered #1, #2 ... from top to bottom, then left to right.)
C29  value 100uF  [CAP ELECTROLITIC RADIAL 6X7-2.5]  (hidden comment: 100uF/25V)
C30  value 100uF  [CAP ELECTROLITIC RADIAL 6X7-2.5]  (hidden comment: 100uF/25V)
D17  1N4007(M7)  [Diode 1N4007 SMD]
D20  1N4007(M7)  [Diode 1N4007 SMD]
D21  1N4007(M7)  [Diode 1N4007 SMD]
D22  1N4007(M7)  [Diode 1N4007 SMD]
D23  1N4007(M7)  [Diode 1N4007 SMD]
K2  RELAY-12V / 8PIN  [MY_REL2]
OP1  2501  [SMT Gullwing Lead-Form]
R45#2  39k/805  [my805]
R60  120R/1206  [my1206]
R61  120R/1206  [my1206]
T8  C945  [SOT23_N]

### Ports
13.6V, GND, SP-N-sim800, SP-P-sim800, T-LIN, TEL1, TEL2, TEL-REL

### Nets
13.6V: D17.2(K) K2.8 ; port 13.6V
GND: T8.2(E) ; port GND
SP-N-sim800: C30.2 ; port SP-N-sim800
SP-P-sim800: C29.1 ; port SP-P-sim800
T-LIN: OP1.4(C) T8.3(C) ; port T-LIN
TEL1: D21.2(K) D22.1(A) K2.2 ; port TEL1
TEL2: D20.2(K) D23.1(A) R61.1 ; port TEL2
TEL-REL: D17.1(A) K2.7 ; port TEL-REL
NetC29_2: C29.2 K2.1 R60.2
NetC30_1: C30.1 K2.4 R60.1
NetD20_1: D20.1(A) D21.1(A) OP1.2(K)
NetD22_2: D22.2(K) D23.2(K) R45#2.1
NetK2_5: K2.5 R61.2
NetOP1_1: OP1.1(A) R45#2.2
NetOP1_3: OP1.3(E) T8.1(B)

Not connected (* = marked no-connect by the designer): K2 3 6

### Notes on the sheet
- SMART
- Serial Number:
- Revision:
- ALARM
- Sheet       of
- Title:
- Sheet Size: B
- Author:
- Approved By:
- Date:
- Drawn By:
- File:

### Library data of the parts
C29 C30 = Cap2: Cap electrolitic radial; Published: 23-Sep-2002; PackageReference: CAPR5-4X5; Publisher: Altium Limited
D17 D20-D23 = Diode 1N4007: Diode; Published: 8-Jun-2000; LatestRevisionDate: 17-Jul-2002; LatestRevisionNote: Re-released for DXP Platform.; DatasheetVersion: 1998; PackageVersion: Aug-1999; PackageReference: DO-41; Publisher: Altium Limited; Code_JEDEC: DO-204-AL; ComponentLink1Description: Manufacturer Link; ComponentLink1URL: http://www.fairchildsemi.com/; ComponentLink2Description: Datasheet; ComponentLink2URL: http://www.fairchildsemi.com/ds/1N%2F1N4001.pdf
K2 = RELAY-DPDT
OP1 = Optoisolator1: 4-Pin Optocoupler; Published: 24-Mar-1999; LatestRevisionDate: 04-Mar-2005; LatestRevisionNote: Sch pins 3 & 4 Swapped.; DatasheetVersion: Nov-2003; PackageReference: DIP-4; Publisher: Altium Limited
R45#2 = Res1: RES 805
R60 R61 = Res1: RES 805; Value: 10K; Published: 8-Jun-2000; LatestRevisionDate: 17-Jul-2002; LatestRevisionNote: Re-released for DXP Platform.; PackageReference: AXIAL-0.3; Publisher: Altium Limited
T8 = C945: SMD; Published: 2017-2-8; LatestRevisionDate: 2017; LatestRevisionNote: IPC-7351 Footprint Added.; DatasheetVersion: 2017; PackageVersion: 2017-2-8; PackageReference: SOT23; Publisher: Abbas Basereh; PackageDescription: 3-Pin SOT-23 Package 0.95 mm Pitch, 2.3 mm Lead Span; ComponentLink1Description: Manufacturer Link; ComponentLink1URL: http://www.taitroncomponents.com/; ComponentLink2Description: Datasheet; ComponentLink2URL: http://www.taitroncomponents.com/

## Sheet GZ7_1_x-ULN2003.SchDoc: GZ8-4-0
size B; SheetNumber: 8; SheetTotal: 10
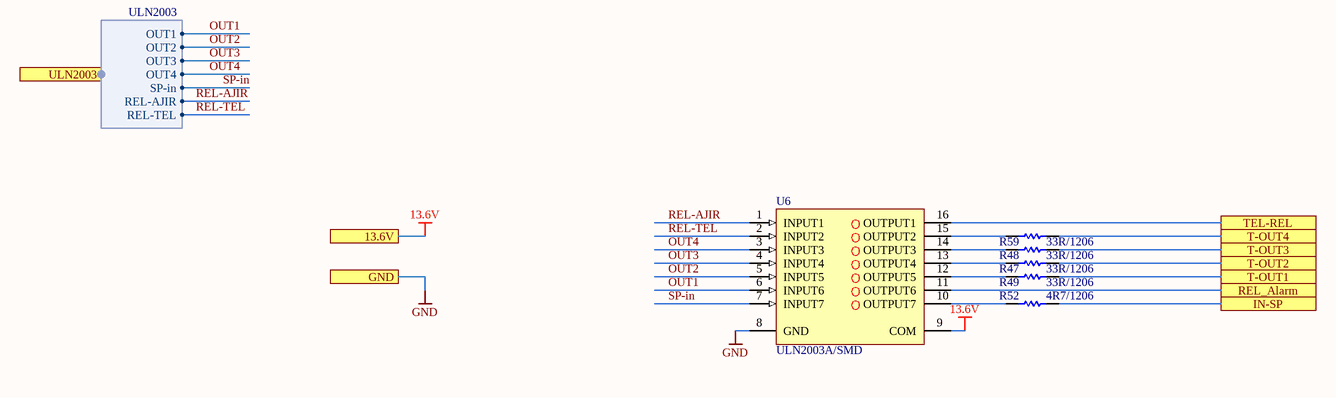
[diagram p7: GZ7_1_x-ULN2003.SchDoc]

### Parts
R47  33R/1206  [my1206]
R48  33R/1206  [MY1206]
R49  33R/1206  [my1206]
R52  4R7/1206  [RES-(1/2)DS]
R59  33R/1206  [MY1206]
U6  ULN2003A/SMD  [SO-16]

### Ports
13.6V, GND, IN-SP, REL_Alarm, T-OUT1, T-OUT2, T-OUT3, T-OUT4, TEL-REL, ULN2003 (harness ULN2003)

### Harnesses
ULN2003: OUT1, OUT2, OUT3, SP-in, REL-AJIR, OUT4, REL-TEL

### Nets
13.6V: U6.9(COM) ; port 13.6V
GND: U6.8(GND) ; port GND
OUT1: U6.6(INPUT6) ; port ULN2003.OUT1
OUT2: U6.5(INPUT5) ; port ULN2003.OUT2
OUT3: U6.4(INPUT4) ; port ULN2003.OUT3
OUT4: U6.3(INPUT3) ; port ULN2003.OUT4
Rel Alarm: U6.11(OUTPUT6) ; port REL_Alarm
REL-AJIR: U6.1(INPUT1) ; port ULN2003.REL-AJIR
REL-TEL: U6.2(INPUT2) ; port ULN2003.REL-TEL
SP-in: U6.7(INPUT7) ; port ULN2003.SP-in
TEL-REL: U6.16(OUTPUT1) ; port TEL-REL
NetJ4_1: R49.2 ; port T-OUT1
NetJ4_2: R47.2 ; port T-OUT2
NetJ4_3: R48.2 ; port T-OUT3
NetJ4_4: R59.2 ; port T-OUT4
NetR47_1: R47.1 U6.13(OUTPUT4)
NetR48_1: R48.1 U6.14(OUTPUT3)
NetR49_1: R49.1 U6.12(OUTPUT5)
NetR52_1: R52.1 U6.10(OUTPUT7)
NetR52_2: R52.2 ; port IN-SP
NetR59_1: R59.1 U6.15(OUTPUT2)

### Notes on the sheet
- Serial Number:
- Altium Vip Course
- Title:
- Revision:
- Approved By:
- Date:
- Sheet       of
- SheetTotal
- Sheet Size: B
- File:

### Library data of the parts
R47-R49 R59 = RES 1206 0.25W: RES 1206; Designer: Abbas Basereh; Desc.: RES SMD 1206; Data: 16-12-2016
R52 = RES Axial 0.5W: RES Axial 1/4W; Designer: Abbas Basereh; Desc.: RES Axial 0.5W; Data: 4-1-2017
U6 = ULN2003A: ComponentLink1Description: Datasheet; ComponentLink2URL: http://www.st.com

## Sheet GZ7_1_x-SIM800C.SchDoc: GZ8-4-0
size B; SheetNumber: 6; SheetTotal: 10
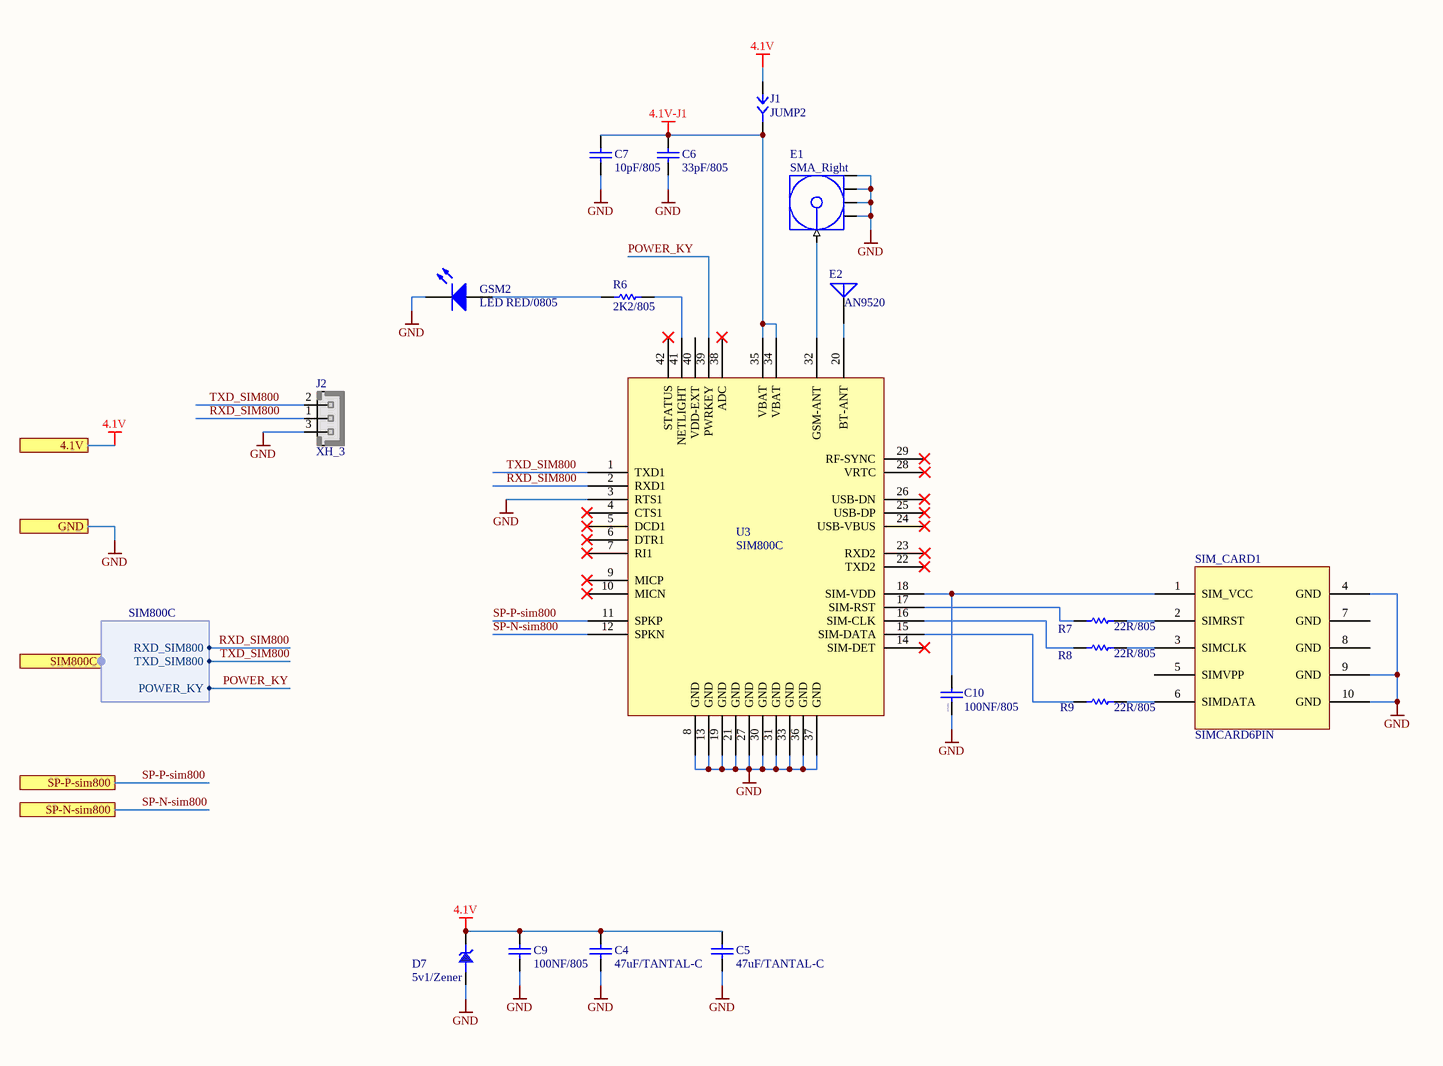
[diagram p8: GZ7_1_x-SIM800C.SchDoc]

### Parts
C4  47uF/TANTAL-C  [C-TT1]
C5  47uF/TANTAL-C  [C-TT1]
C6  33pF/805  [MY805 COP]
C7  10pF/805  [MY805 COP]
C9  100NF/805  [MY805 COP]
C10  100NF/805  [MY805 COP]
D7  5v1/Zener  [my-DO5X.1.5]
E1  SMA_Right  [MCX5.08-H5]
E2  AN9520  [ANT-SMD]
GSM2  LED RED/0805  [LED_SMD_0805]
J1  JUMP2  [JUMP3]
J2  XH_3  [XH_3]
R6  2K2/805  [my805]
R7  22R/805  [my805]
R8  22R/805  [my805]
R9  22R/805  [my805]
SIM_CARD1  SIMCARD6PIN  [MinSim]
U3  SIM800C  [SIM800C_2]

### Ports
4.1V, GND, SIM800C (harness SIM800C), SP-N-sim800, SP-P-sim800

### Harnesses
SIM800C: TXD_SIM800, RXD_SIM800, POWER_KY

### Nets
4.1V: C4.1 C5.1 C9.1 D7.2 J1.2 ; port 4.1V
4.1V-J1: C6.1 C7.1 J1.1 U3.34(VBAT) U3.35(VBAT)
GND: C4.2 C5.2 C6.2 C7.2 C9.2 C10.1 D7.1 E1.2(GND) E1.3(GND) E1.4(GND) E1.5(GND) GSM2.2(K) J2.3 SIM_CARD1.4(GND) SIM_CARD1.9(GND) SIM_CARD1.10(GND) U3.3(RTS1) U3.8(GND) U3.13(GND) U3.19(GND) U3.21(GND) U3.27(GND) U3.30(GND) U3.31(GND) U3.33(GND) U3.36(GND) U3.37(GND) ; port GND
POWER_KY: U3.39(PWRKEY) ; port SIM800C.POWER_KY
RXD_SIM800: J2.1 U3.2(RXD1) ; port SIM800C.RXD_SIM800
SP-N-sim800: U3.12(SPKN) ; port SP-N-sim800
SP-P-sim800: U3.11(SPKP) ; port SP-P-sim800
TXD_SIM800: J2.2 U3.1(TXD1) ; port SIM800C.TXD_SIM800
NetC10_2: C10.2 SIM_CARD1.1(SIM_VCC) U3.18(SIM-VDD)
NetE1_1: E1.1(Signal) U3.32(GSM-ANT)
NetE2_1: E2.1(A) U3.20(BT-ANT)
NetGSM2_1: GSM2.1(A) R6.1
NetR6_2: R6.2 U3.41(NETLIGHT)
NetR7_1: R7.1 SIM_CARD1.2(SIMRST)
NetR7_2: R7.2 U3.17(SIM-RST)
NetR8_1: R8.1 SIM_CARD1.3(SIMCLK)
NetR8_2: R8.2 U3.16(SIM-CLK)
NetR9_1: R9.1 SIM_CARD1.6(SIMDATA)
NetR9_2: R9.2 U3.15(SIM-DATA)

Not connected (* = marked no-connect by the designer): SIM_CARD1 5(SIMVPP) 7(GND) 8(GND); U3 4(CTS1)* 5(DCD1)* 6(DTR1)* 7(RI1)* 9(MICP)* 10(MICN)* 14(SIM-DET)* 22(TXD2)* 23(RXD2)* 24(USB-VBUS)* 25(USB-DP)* 26(USB-DN)* 28(VRTC)* 29(RF-SYNC)* 38(ADC)* 40(VDD-EXT) 42(STATUS)*

### Notes on the sheet
- Serial Number:
- Altium Vip Course
- Title:
- Revision:
- Approved By:
- Date:
- Sheet       of
- SheetTotal
- Sheet Size: B
- File:
- (in symbol CAP) @ebrahim

### Library data of the parts
C4 C5 = Cap Semi: TANTAL
C6 = Cap Semi: CAP 0805; Value: 100NF; Published: 8-Jun-2000; LatestRevisionDate: 29-May-2009; LatestRevisionNote: IPC-7351 Footprint Added.; PackageReference: C1206; Publisher: Altium Limited; PackageDescription: Chip Capacitor
C7 = Cap Semi: CAP 0805; Value: 10pF; Published: 8-Jun-2000; LatestRevisionDate: 29-May-2009; LatestRevisionNote: IPC-7351 Footprint Added.; PackageReference: C1206; Publisher: Altium Limited; PackageDescription: Chip Capacitor
C9 = Cap Semi: CAP 0805; Published: 8-Jun-2000; LatestRevisionDate: 29-May-2009; LatestRevisionNote: IPC-7351 Footprint Added.; PackageReference: C1206; Publisher: Altium Limited; PackageDescription: Chip Capacitor
C10 = CAP: CAP 0805
D7 = Zener
E1 = COAX-F: 50 Ohm Impedance; PCB_Layout: Complies with manufacturer's recommendation.; DrillSize: Corresponds to nominal value.; Published: 15-Jul-2004; LatestRevisionDate: 15-Jul-2004; LatestRevisionNote: Component Replaced.; DatasheetDocument: 30-May-2003; PackageDocument: 04-Jul-1999; PackageReference: 919-119J-51AX; Publisher: Altium Limited; ComponentLink1Description: Manufacturer Link; ComponentLink1URL: http://www.amphenolrf.com/
E2 = Antenna: Multilayer Chip Antenna; Published: 24-Mar-1999; LatestRevisionDate: 17-Jul-2002; LatestRevisionNote: Re-released for DXP Platform.; PackageReference: PIN1; Publisher: Altium Limited
GSM2 = LED2: Published: 8-Jun-2000; LatestRevisionDate: 17-Jul-2002; LatestRevisionNote: Re-released for DXP Platform.; PackageVersion: Feb-2002; PackageReference: 3.2X1.6X1.1; Publisher: Altium Limited; PackageDescription: SM LED; 2 Flat Leads
J2 = XH_3: PW10-x-M, JST-BxB-XH-A pitch: 2.5mm, 3A/250v; MANF: JST; MANF_P#: B3B-XH-A; PARAM2: 250v; PARAM: 3.0A; VALUE: XH_3
R6 = Res1: RES 805
R7-R9 = Res1: RES 805; Value: 22R; Published: 8-Jun-2000; LatestRevisionDate: 17-Jul-2002; LatestRevisionNote: Re-released for DXP Platform.; PackageReference: AXIAL-0.3; Publisher: Altium Limited

## Sheet GZ7_1_x-ALARM.SchDoc: GZ4E-1-0
size B; Revision: 3.1; SheetNumber: 3; SheetTotal: 9
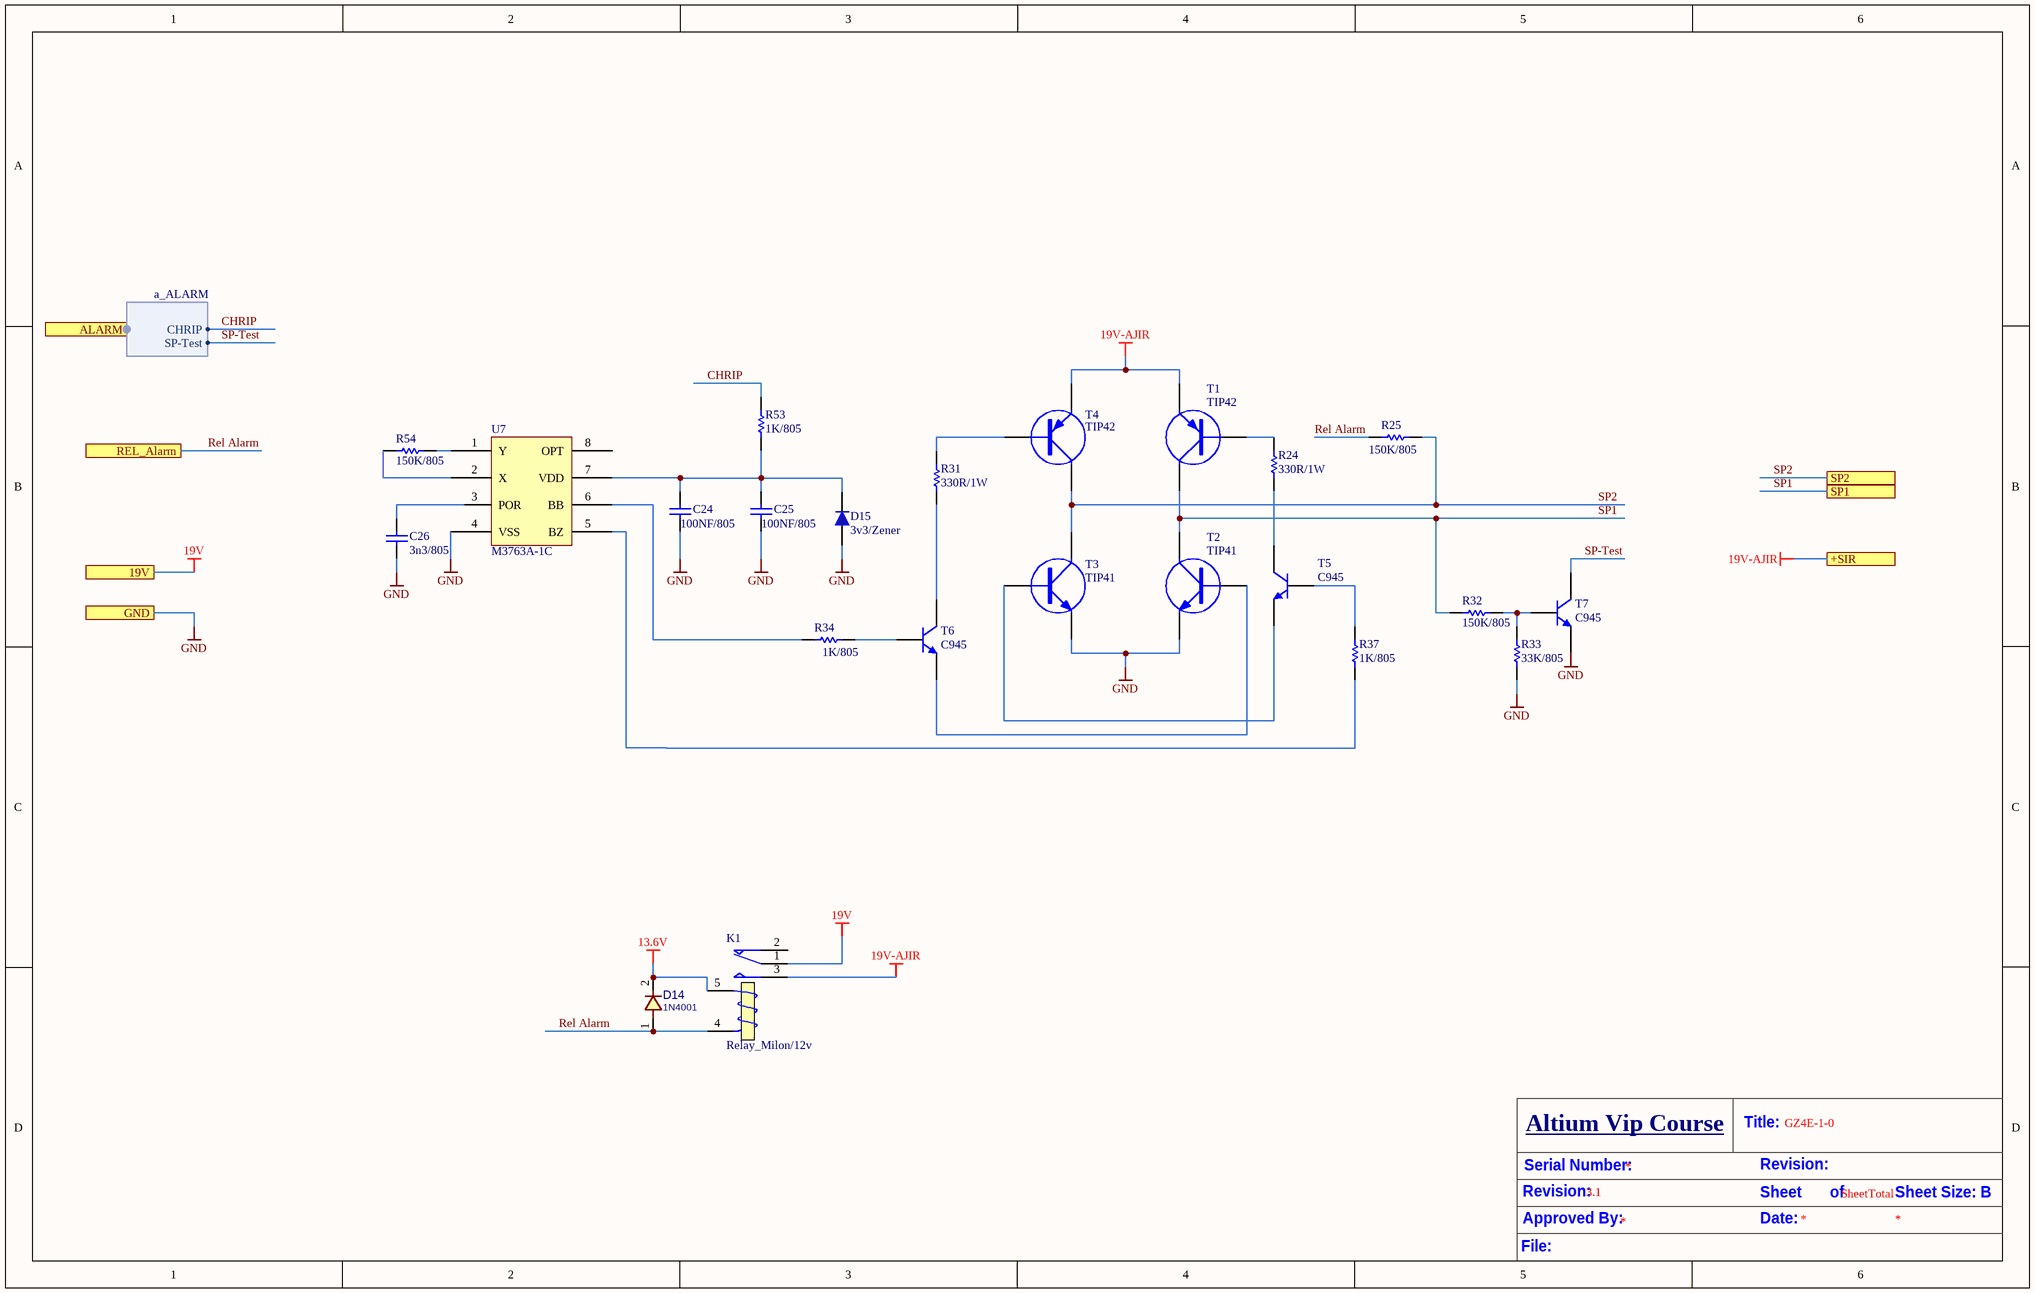
[diagram p9: GZ7_1_x-ALARM.SchDoc]

### Parts
C24  100NF/805  [MY805 COP]
C25  100NF/805  [MY805 COP]
C26  3n3/805  [MY805 COP]
D14  1N4001  [DIODE 1N4007 SMD]
D15  3v3/Zener  [my-DO5X.1.5]
K1  Relay_Milon/12v  [REL]
R24  330R/1W  [R2512]
R25  150K/805  [my805]
R31  330R/1W  [R2512]
R32  150K/805  [my805]
R33  33K/805  [my805]
R34  1K/805  [my805]
R37  1K/805  [my805]
R53  1K/805  [my805]
R54  150K/805  [my805]
T1  TIP42  [TO-220 AB]
T2  TIP41  [TO-220 AB]
T3  TIP41  [TO-220 AB]
T4  TIP42  [TO-220 AB]
T5  C945  [SOT23_N]
T6  C945  [SOT23_N]
T7  C945  [SOT23_N]
U7  M3763A-1C  [DIP8]

### Ports
19V, +SIR, ALARM (harness a_ALARM), GND, REL_Alarm, SP1, SP2

### Harnesses
a_ALARM: SP-Test, CHRIP

### Nets
13.6V: D14.2 K1.5(T2)
19V: K1.1(COM) ; port 19V  [project net +19V]
19V-AJIR: K1.3(NO) T1.3(C) T4.3(C) ; port +SIR
GND: C24.1 C25.1 C26.1 D15.1 R33.2 T2.3(E) T3.3(E) T7.2(E) U7.4(VSS) ; port GND
CHRIP: R53.2 ; port ALARM.CHRIP
Rel Alarm: D14.1 K1.4(T1) R25.1 ; port REL_Alarm
SP1: R32.1 T1.2(E) T2.2(C) ; port SP1
SP2: R25.2 T3.2(C) T4.2(E) ; port SP2
SP-Test: T7.3(C) ; port ALARM.SP-Test
NetC24_2: C24.2 C25.2 D15.2 R53.1 U7.7(VDD)
NetC26_2: C26.2 U7.3(POR)
NetR24_1: R24.1 T5.3(C)
NetR24_2: R24.2 T1.1(B)
NetR31_1: R31.1 T6.3(C)
NetR31_2: R31.2 T4.1(B)
NetR32_2: R32.2 R33.1 T7.1(B)
NetR34_1: R34.1 T6.1(B)
NetR34_2: R34.2 U7.6(BB)
NetR37_1: R37.1 U7.5(BZ)
NetR37_2: R37.2 T5.1(B)
NetR54_1: R54.1 U7.2(X)
NetR54_2: R54.2 U7.1(Y)
NetT2_1: T2.1(B) T6.2(E)
NetT3_1: T3.1(B) T5.2(E)

Not connected (* = marked no-connect by the designer): K1 2(NC); U7 8(OPT)

### Notes on the sheet
- Serial Number:
- Altium Vip Course
- Title:
- Revision:
- Approved By:
- Date:
- Sheet       of
- SheetTotal
- Sheet Size: B
- File:

### Library data of the parts
C24-C26 = CAP SMD 0805: CAP 0805; Designer: Abbas Basereh; Desc.: CAP SMD 0805; Data: 16-12-2016
D14 = DIODE_THD: DIODE, THD; DESC: DESCRIPTION; PARAM: 100V; PARAM2: 1A; MANF: MANF; ASSEMBLY: ASSEMBLY; PRICE: PRICE; MANF_P#: 1N4001; VALUE: 1N4001
D15 = 1N4148 SMD: Zener
K1 = RELAY General: Relay_Milon; Designer: Ali Hafizi; Company: E.P.I.L; Design_Date: 2011/10/31
R24 R31 = RES Axial 1W: Designer: Abbas Basereh; Desc.: RES Axial 1W; Data: 4-1-2017
R25 R32 R33 = RES Axial 1W: RES 805; Designer: Abbas Basereh; Desc.: RES Axial 1W; Data: 4-1-2017
R34 R37 R53 R54 = RES 1206 0.25W: as R1 on sheet GZ7_1_x-POWER; Data: 16-12-2016
T1 T4 = PNP: PNP Transistor
T2 T3 = NPN: NPN Transistor
T5-T7 = C945: NPN Transistor; Published: 2017-2-8; LatestRevisionDate: 2017; LatestRevisionNote: IPC-7351 Footprint Added.; DatasheetVersion: 2017; PackageVersion: 2017-2-8; PackageReference: SOT23; Publisher: Abbas Basereh; PackageDescription: 3-Pin SOT-23 Package 0.95 mm Pitch, 2.3 mm Lead Span; ComponentLink1Description: Manufacturer Link; ComponentLink1URL: http://www.taitroncomponents.com/; ComponentLink2Description: Datasheet; ComponentLink2URL: http://www.taitroncomponents.com/

## Nets that join several sheets
4.1V: GZ7_1_x-POWER (C8.1 R3.2 U2.4), GZ7_1_x-User_Interface (GSM.2 POWER.2 SYSTEM.2), GZ7_1_x-CORE (J3.2 P1.6), GZ7_1_x-SIM800C (5 pins)
4.1V-J2: GZ7_1_x-REMOT (L1.1), GZ7_1_x-CORE (7 pins)
13.6V: Main (SP.2), GZ7_1_x-POWER (9 pins), GZ7_1_x-ZON (8 pins), GZ7_1_x-TEL (D17.2 K2.8), GZ7_1_x-ULN2003 (U6.9), GZ7_1_x-ALARM (D14.2 K1.5)
19V-AJIR: Main (JB2.6), GZ7_1_x-ALARM (K1.3 T1.3 T4.3)
+19V: GZ7_1_x-POWER (5 pins), GZ7_1_x-ALARM (K1.1)
GND: Main (8 pins), GZ7_1_x-POWER (19 pins), GZ7_1_x-ZON (16 pins), GZ7_1_x-User_Interface (9 pins), GZ7_1_x-REMOT (C15.2 U5.9), GZ7_1_x-CORE (10 pins), GZ7_1_x-TEL (T8.2), GZ7_1_x-ULN2003 (U6.8), GZ7_1_x-SIM800C (27 pins), GZ7_1_x-ALARM (9 pins)
+AUX: Main (J6.6 JB2.4), GZ7_1_x-POWER (F2.2 R13.2 R20.2)
+BAT: Main (JB2.2), GZ7_1_x-POWER (F1.2)
AC1: Main (JB1.2), GZ7_1_x-POWER (D1.2 D3.1)
AC2: Main (JB1.1), GZ7_1_x-POWER (D2.2 D4.1 R17.1)
CHRIP: GZ7_1_x-CORE (U4.5), GZ7_1_x-ALARM (R53.2)
DATA RXB: GZ7_1_x-REMOT (U5.8), GZ7_1_x-CORE (U4.41)
Fuz: GZ7_1_x-POWER (C12.2 D9.2 R19.2 R20.1), GZ7_1_x-CORE (U4.60)
IN-Z1: Main (J5.1), GZ7_1_x-ZON (R35.1)
IN-Z2: Main (J5.3), GZ7_1_x-ZON (R42.1)
IN-Z3: Main (J5.4), GZ7_1_x-ZON (R45#1.1)
IN-Z4: Main (J5.6), GZ7_1_x-ZON (R50.1)
IN-Z5: Main (J5.7), GZ7_1_x-ZON (R56.1)
IN-Z6: Main (J6.1), GZ7_1_x-ZON (R63.1)
IN-Z7: Main (J6.2), GZ7_1_x-ZON (R66.1)
IN-Z8: Main (J6.4), GZ7_1_x-ZON (R69.1)
LED_GSM_BLUE: GZ7_1_x-User_Interface (R14.2), GZ7_1_x-CORE (U4.54)
LED_GSM_GREEN: GZ7_1_x-User_Interface (R15.2), GZ7_1_x-CORE (U4.55)
LED_GSM_RED: GZ7_1_x-User_Interface (R16.2), GZ7_1_x-CORE (U4.51)
LED_POWER_BLUE: GZ7_1_x-User_Interface (R10.2), GZ7_1_x-CORE (U4.50)
LED_POWER_GREEN: GZ7_1_x-User_Interface (R11.2), GZ7_1_x-CORE (U4.49)
LED_POWER_RED: GZ7_1_x-User_Interface (R12.2), GZ7_1_x-CORE (U4.47)
LED_SYSTEM_BLUE: GZ7_1_x-User_Interface (R28.2), GZ7_1_x-CORE (U4.56)
LED_SYSTEM_GREEN: GZ7_1_x-User_Interface (R29.2), GZ7_1_x-CORE (U4.57)
LED_SYSTEM_RED: GZ7_1_x-User_Interface (R30.2), GZ7_1_x-CORE (U4.58)
LED_Z1: GZ7_1_x-User_Interface (R23.2), GZ7_1_x-CORE (U4.7)
LED_Z2: GZ7_1_x-User_Interface (R26.2), GZ7_1_x-CORE (U4.9)
LED_Z3: GZ7_1_x-User_Interface (R22.2), GZ7_1_x-CORE (U4.12)
LED_Z4: GZ7_1_x-User_Interface (R27.2), GZ7_1_x-CORE (U4.14)
LED_Z5: GZ7_1_x-User_Interface (R58.2), GZ7_1_x-CORE (U4.16)
LED_Z6: GZ7_1_x-User_Interface (R71.2), GZ7_1_x-CORE (U4.18)
LED_Z7: GZ7_1_x-User_Interface (R72.2), GZ7_1_x-CORE (U4.25)
LED_Z8: GZ7_1_x-User_Interface (R73.2), GZ7_1_x-CORE (U4.29)
NetANT1_1: Main (ANT1.1), GZ7_1_x-REMOT (U5.1 U5.5)
NetJ4_1: Main (J4.1), GZ7_1_x-ULN2003 (R49.2)
NetJ4_2: Main (J4.2), GZ7_1_x-ULN2003 (R47.2)
NetJ4_3: Main (J4.3), GZ7_1_x-ULN2003 (R48.2)
NetJ4_4: Main (J4.4), GZ7_1_x-ULN2003 (R59.2)
NetR52_2: Main (SP.1), GZ7_1_x-ULN2003 (R52.2)
OUT1: GZ7_1_x-CORE (U4.31), GZ7_1_x-ULN2003 (U6.6)
OUT2: GZ7_1_x-CORE (U4.34), GZ7_1_x-ULN2003 (U6.5)
OUT3: GZ7_1_x-CORE (U4.35), GZ7_1_x-ULN2003 (U6.4)
OUT4: GZ7_1_x-CORE (U4.36), GZ7_1_x-ULN2003 (U6.3)
POWER: GZ7_1_x-POWER (C11.2 D8.2 R21.2), GZ7_1_x-CORE (U4.59)
POWER_KY: GZ7_1_x-CORE (U4.46), GZ7_1_x-SIM800C (U3.39)
Rel Alarm: GZ7_1_x-ULN2003 (U6.11), GZ7_1_x-ALARM (D14.1 K1.4 R25.1)
REL-AJIR: GZ7_1_x-CORE (U4.38), GZ7_1_x-ULN2003 (U6.1)
REL-TEL: GZ7_1_x-CORE (U4.37), GZ7_1_x-ULN2003 (U6.2)
RXD_SIM800: GZ7_1_x-CORE (U4.28), GZ7_1_x-SIM800C (J2.1 U3.2)
SP1: Main (JB2.7), GZ7_1_x-ALARM (R32.1 T1.2 T2.2)
SP2: Main (JB2.8), GZ7_1_x-ALARM (R25.2 T3.2 T4.2)
SP-in: GZ7_1_x-CORE (U4.30), GZ7_1_x-ULN2003 (U6.7)
SP-N-sim800: GZ7_1_x-TEL (C30.2), GZ7_1_x-SIM800C (U3.12)
SP-P-sim800: GZ7_1_x-TEL (C29.1), GZ7_1_x-SIM800C (U3.11)
SP-Test: GZ7_1_x-CORE (U4.4), GZ7_1_x-ALARM (T7.3)
SW_LRN: GZ7_1_x-User_Interface (SW1.2), GZ7_1_x-CORE (U4.48)
T-LIN: GZ7_1_x-CORE (U4.39), GZ7_1_x-TEL (OP1.4 T8.3)
TEL1: Main (J4.5), GZ7_1_x-TEL (D21.2 D22.1 K2.2)
TEL2: Main (J4.6), GZ7_1_x-TEL (D20.2 D23.1 R61.1)
TEL-REL: GZ7_1_x-TEL (D17.1 K2.7), GZ7_1_x-ULN2003 (U6.16)
TXD_SIM800: GZ7_1_x-CORE (U4.27), GZ7_1_x-SIM800C (J2.2 U3.1)
Z1: GZ7_1_x-ZON (R38.1), GZ7_1_x-CORE (U4.6)
Z2: GZ7_1_x-ZON (R39.1), GZ7_1_x-CORE (U4.8)
Z3: GZ7_1_x-ZON (R40.1), GZ7_1_x-CORE (U4.10)
Z4: GZ7_1_x-ZON (R43.1), GZ7_1_x-CORE (U4.13)
Z5: GZ7_1_x-ZON (R57.1), GZ7_1_x-CORE (U4.15)
Z6: GZ7_1_x-ZON (R64.1), GZ7_1_x-CORE (U4.17)
Z7: GZ7_1_x-ZON (R67.1), GZ7_1_x-CORE (U4.19)
Z8: GZ7_1_x-ZON (R70.1), GZ7_1_x-CORE (U4.26)